# EAGLE schematic VNA (EAGLE 9.3.1)

## Sheet 1 of 10
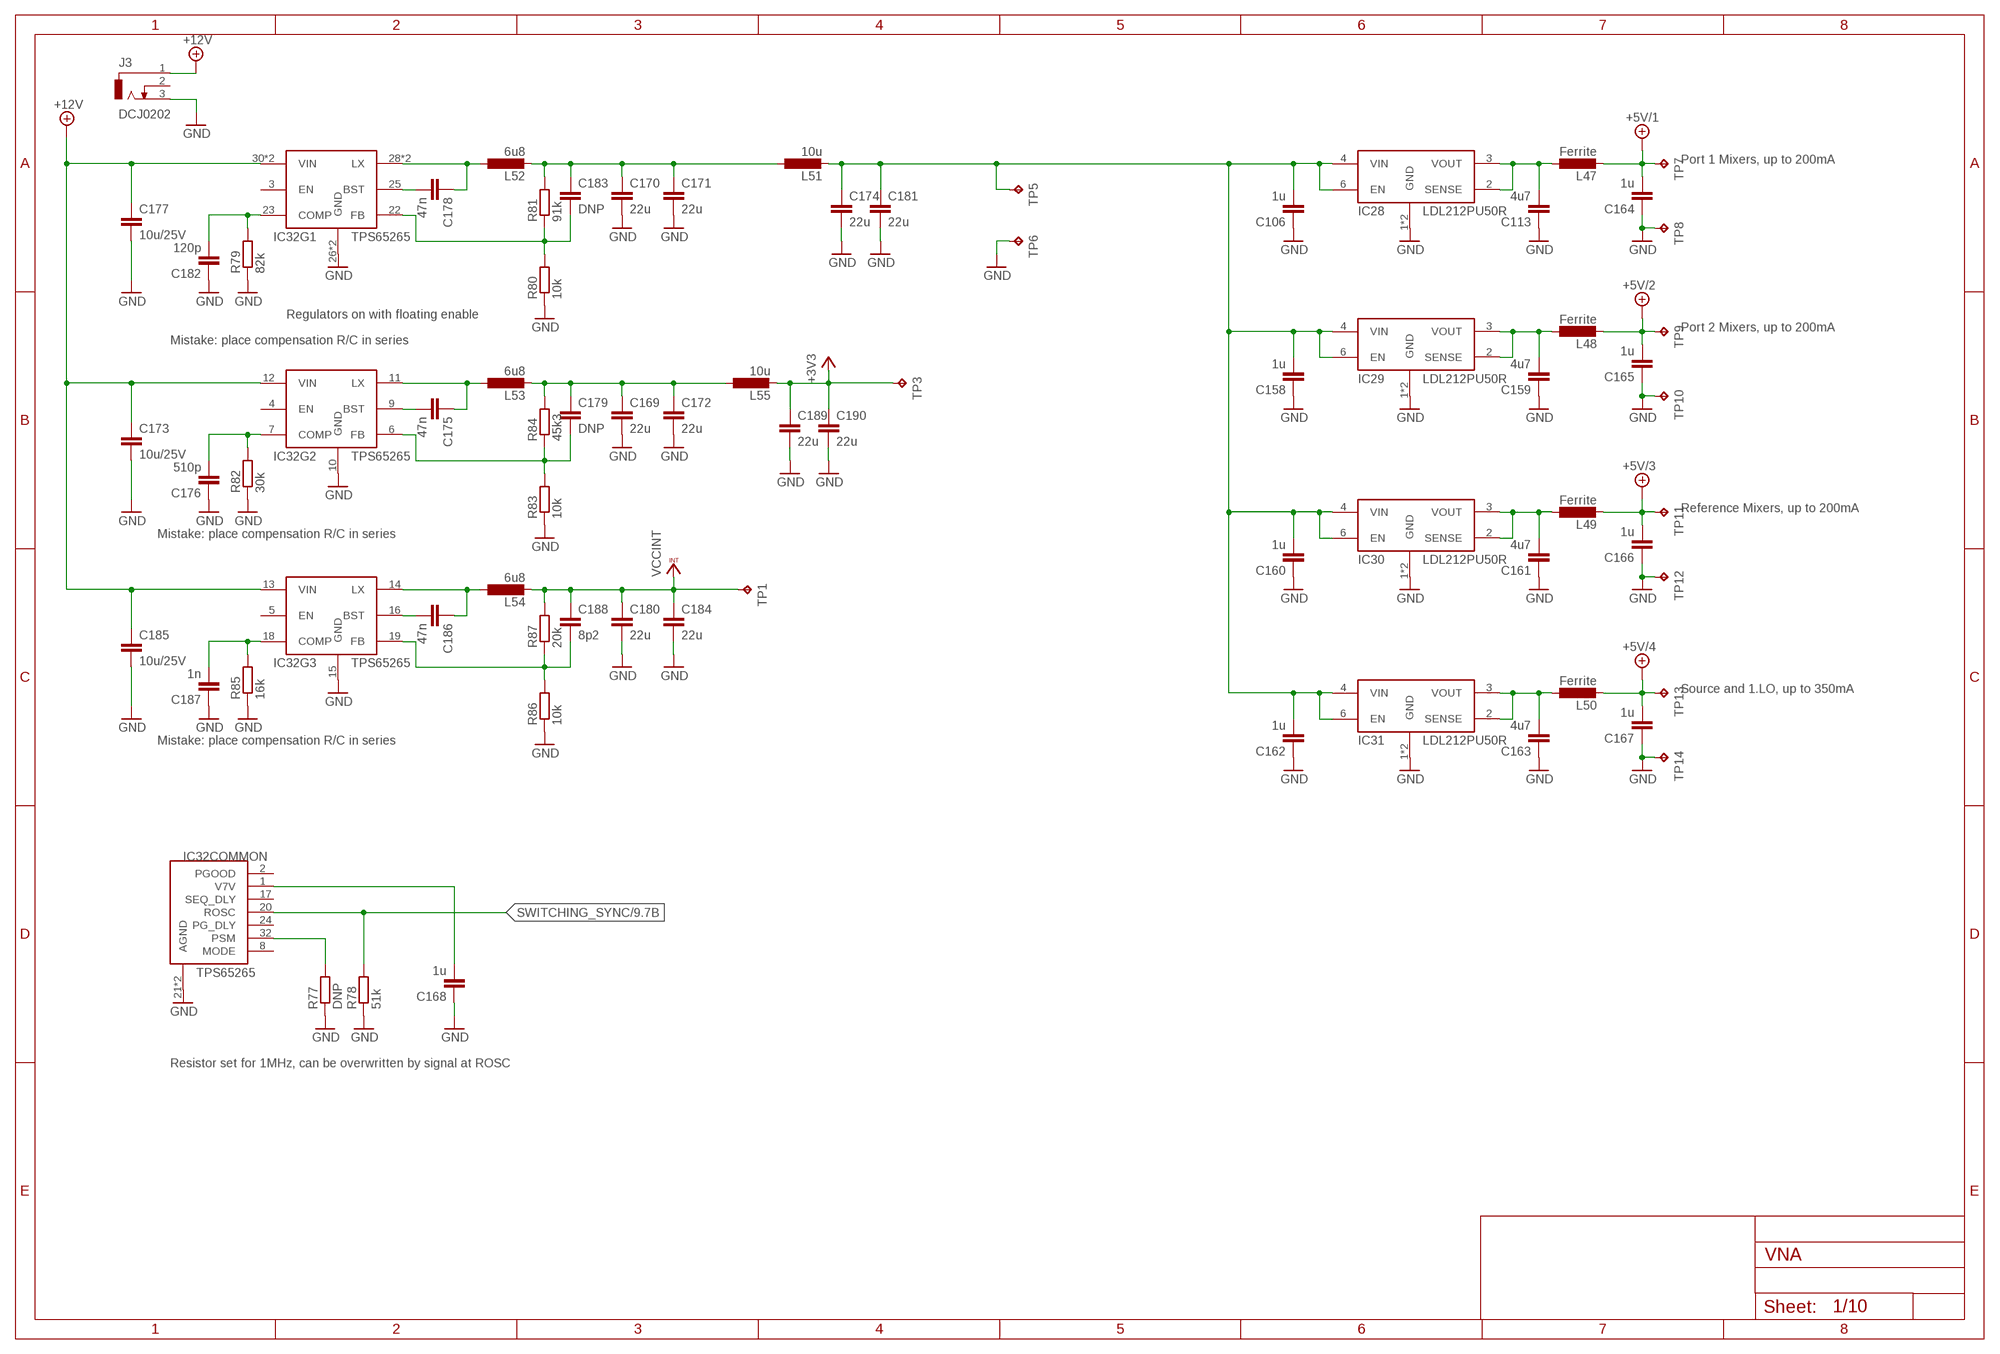
[diagram p0: schematic, sheet 1]

### Parts
C106  1u  C-EUC0603  [C0603]
C113  4u7  C-EUC0603  [C0603]
C158  1u  C-EUC0603  [C0603]
C159  4u7  C-EUC0603  [C0603]
C160  1u  C-EUC0603  [C0603]
C161  4u7  C-EUC0603  [C0603]
C162  1u  C-EUC0603  [C0603]
C163  4u7  C-EUC0603  [C0603]
C164  1u  C-EUC0603  [C0603]
C165  1u  C-EUC0603  [C0603]
C166  1u  C-EUC0603  [C0603]
C167  1u  C-EUC0603  [C0603]
C168  1u  C-EUC0603  [C0603]
C169  22u  C-EUC1206  [C1206]
C170  22u  C-EUC1206  [C1206]
C171  22u  C-EUC1206  [C1206]
C172  22u  C-EUC1206  [C1206]
C173  10u/25V  C-EUC1206  [C1206]
C174  22u  C-EUC1206  [C1206]
C175  47n  C-EUC0603  [C0603]
C176  510p  C-EUC0603  [C0603]
C177  10u/25V  C-EUC1206  [C1206]
C178  47n  C-EUC0603  [C0603]
C179  DNP  C-EUC0603  [C0603]
C180  22u  C-EUC1206  [C1206]
C181  22u  C-EUC1206  [C1206]
C182  120p  C-EUC0603  [C0603]
C183  DNP  C-EUC0603  [C0603]
C184  22u  C-EUC1206  [C1206]
C185  10u/25V  C-EUC1206  [C1206]
C186  47n  C-EUC0603  [C0603]
C187  1n  C-EUC0603  [C0603]
C188  8p2  C-EUC0603  [C0603]
C189  22u  C-EUC1206  [C1206]
C190  22u  C-EUC1206  [C1206]
IC28  LDL212PU50R  [SON95P300X300X100-7T170X240N]
IC29  LDL212PU50R  [SON95P300X300X100-7T170X240N]
IC30  LDL212PU50R  [SON95P300X300X100-7T170X240N]
IC31  LDL212PU50R  [SON95P300X300X100-7T170X240N]
IC32  TPS65265  [QFN50P500X500X100-33T345N]
J3  DCJ0202  [DCJ0202]
L47  Ferrite  INDUCTOR0603  [R0603]
L48  Ferrite  INDUCTOR0603  [R0603]
L49  Ferrite  INDUCTOR0603  [R0603]
L50  Ferrite  INDUCTOR0603  [R0603]
L51  10u  SRN5040  [SRN5040]
L52  6u8  SRN5040  [SRN5040]
L53  6u8  SRN5040  [SRN5040]
L54  6u8  SRN5040  [SRN5040]
L55  10u  SRN5040  [SRN5040]
R77  DNP  R-EU_R0603  [R0603]
R78  51k  R-EU_R0603  [R0603]
R79  82k  R-EU_R0603  [R0603]
R80  10k  R-EU_R0603  [R0603]
R81  91k  R-EU_R0603  [R0603]
R82  30k  R-EU_R0603  [R0603]
R83  10k  R-EU_R0603  [R0603]
R84  45k3  R-EU_R0603  [R0603]
R85  16k  R-EU_R0603  [R0603]
R86  10k  R-EU_R0603  [R0603]
R87  20k  R-EU_R0603  [R0603]
TP1  TPB1,27  [B1,27]
TP3  TPB1,27  [B1,27]
TP5  TPB1,27  [B1,27]
TP6  TPB1,27  [B1,27]
TP7  TPB1,27  [B1,27]
TP8  TPB1,27  [B1,27]
TP9  TPB1,27  [B1,27]
TP10  TPB1,27  [B1,27]
TP11  TPB1,27  [B1,27]
TP12  TPB1,27  [B1,27]
TP13  TPB1,27  [B1,27]
TP14  TPB1,27  [B1,27]

### Nets
+3V3: C189.1 C190.1 L55.P$2 TP3.TP ; also sheet 2,3,4,5,6,7,8,9,10
+5V/1: C164.2 L47.2 TP7.TP ; also sheet 6
+5V/2: C165.2 L48.2 TP9.TP ; also sheet 7
+5V/3: C166.2 L49.2 TP11.TP ; also sheet 8
+5V/4: C167.2 L50.2 TP13.TP ; also sheet 3,5
+12V: C173.1 C177.1 C185.1 IC32.12(VIN) IC32.13(VIN) IC32.30(VIN) IC32.31(VIN) J3.1
GND: C106.1 C113.1 C158.1 C159.1 C160.1 C161.1 C162.1 C163.1 C164.1 C165.1 C166.1 C167.1 C168.1 C169.2 C170.2 C171.2 C172.2 C173.2 C174.2 C176.1 C177.2 C180.2 C181.2 C182.1 C184.2 C185.2 C187.1 C189.2 C190.2 IC28.1(GND) IC28.7(GND) IC29.1(GND) IC29.7(GND) IC30.1(GND) IC30.7(GND) IC31.1(GND) IC31.7(GND) IC32.10(GND) IC32.15(GND) IC32.21(COMMON:AGND) IC32.26(GND) IC32.27(GND) IC32.33(COMMON:AGND) J3.3 R77.1 R78.1 R79.1 R80.1 R82.1 R83.1 R85.1 R86.1 TP6.TP TP8.TP TP10.TP TP12.TP TP14.TP ; also sheet 2,3,4,5,6,7,8,9,10
N$100: C113.2 IC28.2(SENSE) IC28.3(VOUT) L47.1
N$161: C159.2 IC29.2(SENSE) IC29.3(VOUT) L48.1
N$162: C168.2 IC32.1(COMMON:V7V)
N$163: C106.2 C158.2 C160.2 C162.2 C174.1 C181.1 IC28.4(VIN) IC28.6(EN) IC29.4(VIN) IC29.6(EN) IC30.4(VIN) IC30.6(EN) IC31.4(VIN) IC31.6(EN) L51.P$2 TP5.TP
N$164: C161.2 IC30.2(SENSE) IC30.3(VOUT) L49.1
N$166: C163.2 IC31.2(SENSE) IC31.3(VOUT) L50.1
N$167: IC32.32(COMMON:PSM) R77.2
N$168: C178.2 IC32.25(BST)
N$169: C178.1 IC32.28(LX) IC32.29(LX) L52.P$1
N$170: C175.2 IC32.9(BST)
N$171: C175.1 IC32.11(LX) L53.P$1
N$172: C176.2 IC32.7(COMP) R82.2
N$174: C182.2 IC32.23(COMP) R79.2
N$176: C183.2 IC32.22(FB) R80.2 R81.1
N$177: C170.1 C171.1 C183.1 L51.P$1 L52.P$2 R81.2
N$178: C179.2 IC32.6(FB) R83.2 R84.1
N$179: C169.1 C172.1 C179.1 L53.P$2 L55.P$1 R84.2
N$180: C186.2 IC32.16(BST)
N$181: C186.1 IC32.14(LX) L54.P$1
N$182: C187.2 IC32.18(COMP) R85.2
N$184: C188.2 IC32.19(FB) R86.2 R87.1
SWITCHING_SYNC: IC32.20(COMMON:ROSC) R78.2 ; also sheet 9
VCCINT: C180.1 C184.1 C188.1 L54.P$2 R87.2 TP1.TP ; also sheet 9
Unconnected: IC32.2(COMMON:PGOOD) IC32.3(EN) IC32.4(EN) IC32.5(EN) IC32.8(COMMON:MODE) IC32.17(COMMON:SEQ_DLY) IC32.24(COMMON:PG_DLY) J3.2

### Notes on the sheet
- Port 1 Mixers, up to 200mA
- Regulators on with floating enable
- Port 2 Mixers, up to 200mA
- Mistake: place compensation R/C in series
- Reference Mixers, up to 200mA
- Mistake: place compensation R/C in series
- Source and 1.LO, up to 350mA
- Mistake: place compensation R/C in series
- Resistor set for 1MHz, can be overwritten by signal at ROSC

## Sheet 2 of 10: CLK Generation
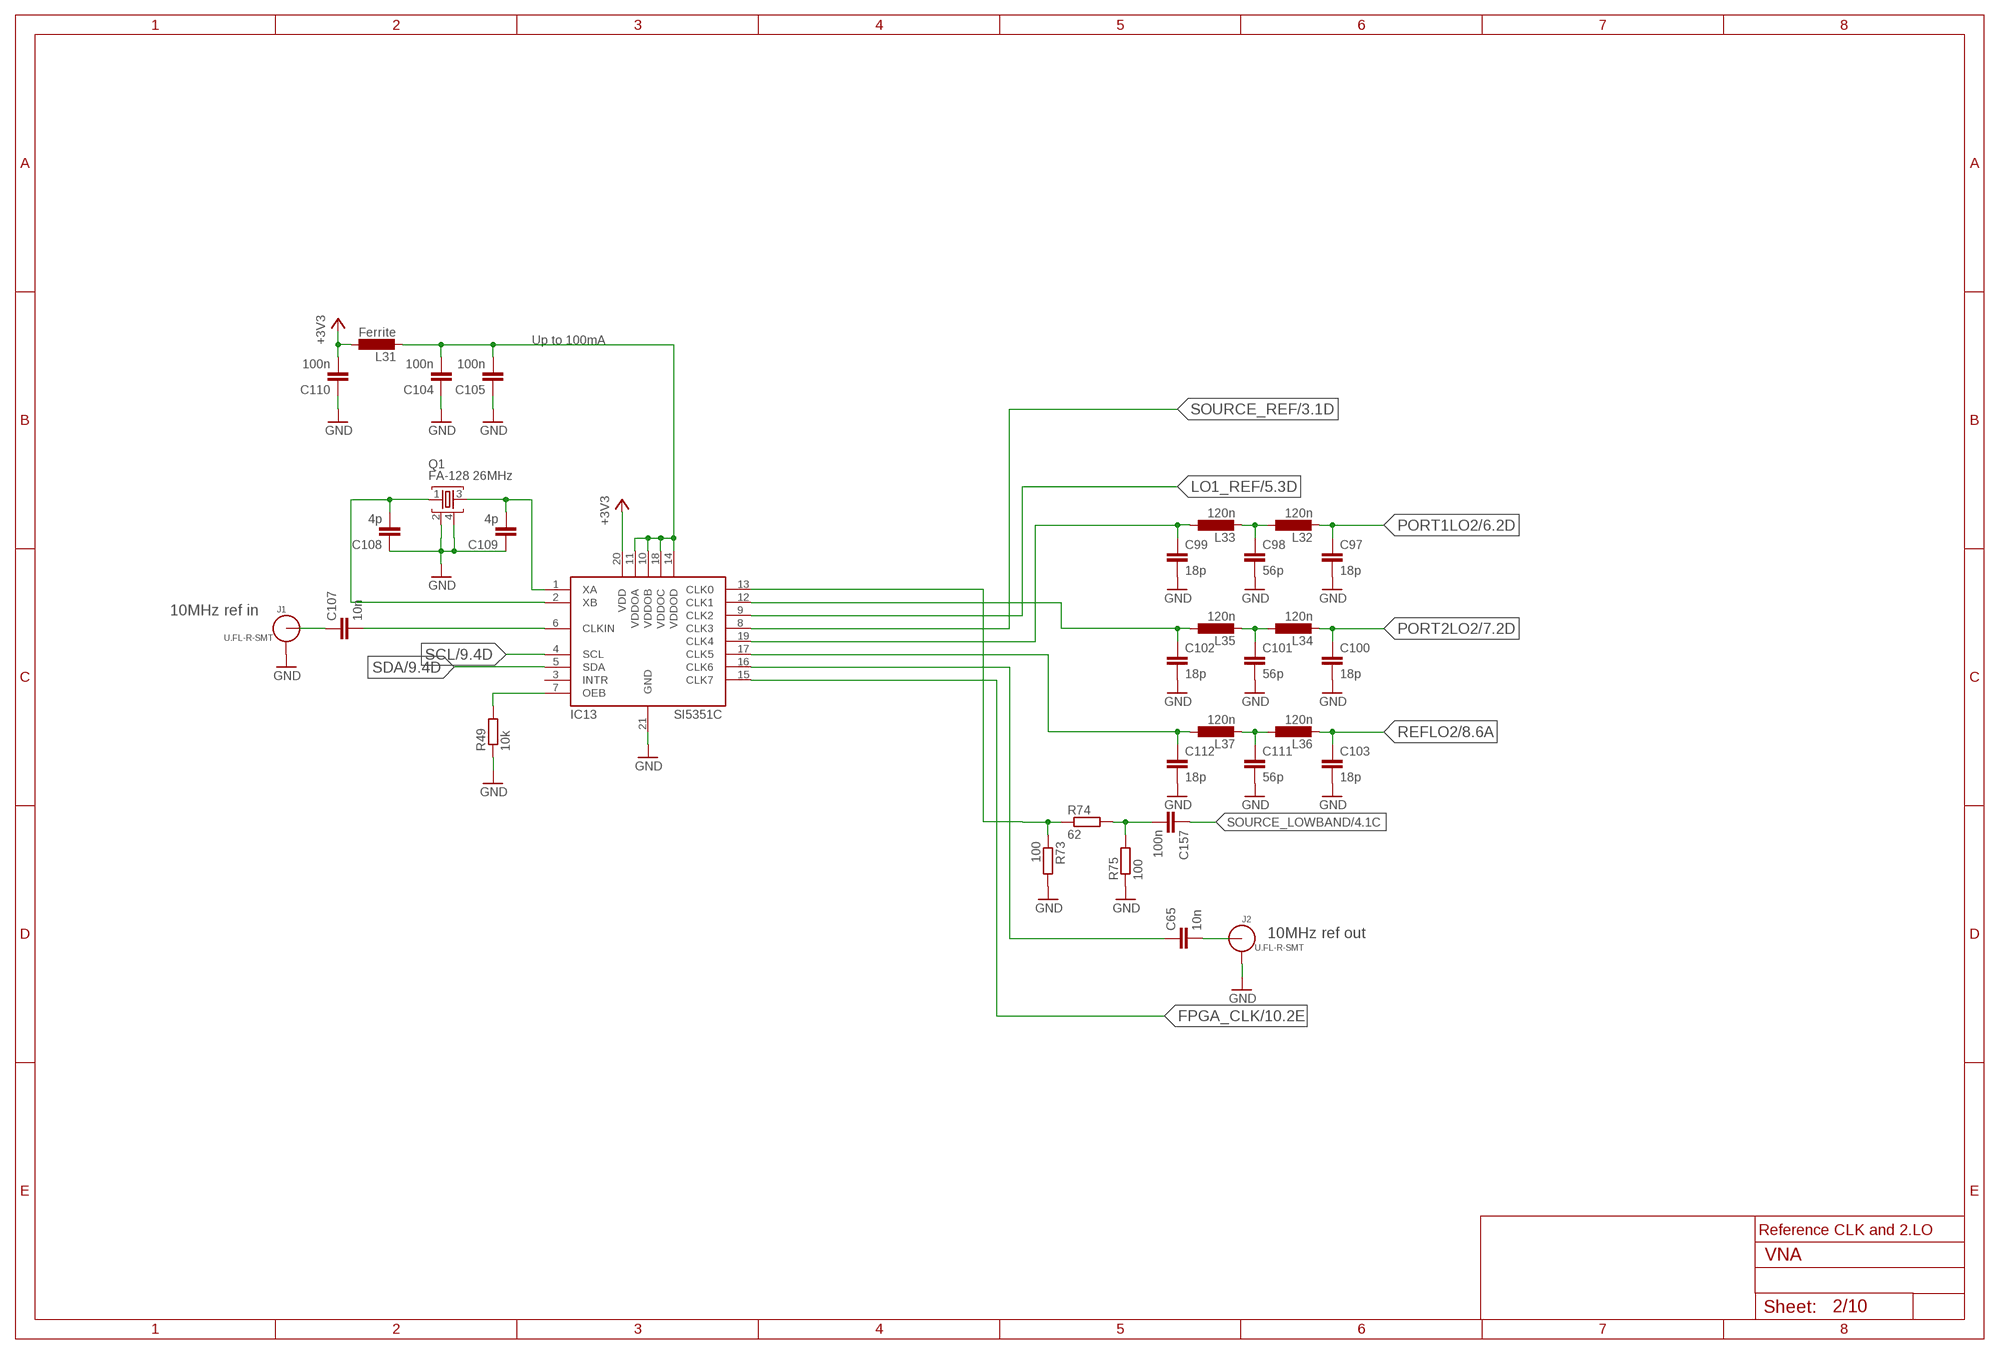
[diagram p1: schematic, sheet 2]

### Parts
C65  10n  C-EUC0603  [C0603]
C97  18p  C-EUC0603  [C0603]
C98  56p  C-EUC0603  [C0603]
C99  18p  C-EUC0603  [C0603]
C100  18p  C-EUC0603  [C0603]
C101  56p  C-EUC0603  [C0603]
C102  18p  C-EUC0603  [C0603]
C103  18p  C-EUC0603  [C0603]
C104  100n  C-EUC0603  [C0603]
C105  100n  C-EUC0603  [C0603]
C107  10n  C-EUC0603  [C0603]
C108  4p  C-EUC0603  [C0603]
C109  4p  C-EUC0603  [C0603]
C110  100n  C-EUC0603  [C0603]
C111  56p  C-EUC0603  [C0603]
C112  18p  C-EUC0603  [C0603]
C157  100n  C-EUC0603  [C0603]
IC13  SI5351C  [QFN50P400X400X90-21T270N]
J1  U.FL-R-SMT  [U.FL_SMT]
J2  U.FL-R-SMT  [U.FL_SMT]
L31  Ferrite  INDUCTOR0603  [R0603]
L32  120n  INDUCTOR0603  [R0603]
L33  120n  INDUCTOR0603  [R0603]
L34  120n  INDUCTOR0603  [R0603]
L35  120n  INDUCTOR0603  [R0603]
L36  120n  INDUCTOR0603  [R0603]
L37  120n  INDUCTOR0603  [R0603]
Q1  FA-128 26MHz  FA-128  [FA-128]
R49  10k  R-EU_R0603  [R0603]
R73  100  R-EU_R0603  [R0603]
R74  62  R-EU_R0603  [R0603]
R75  100  R-EU_R0603  [R0603]

### Nets
+3V3: C110.2 IC13.20(VDD) L31.1 ; also sheet 1,3,4,5,6,7,8,9,10
FPGA_CLK: IC13.15(CLK7) ; also sheet 10
GND: C97.2 C98.2 C99.2 C100.2 C101.2 C102.2 C103.2 C104.1 C105.1 C108.1 C109.1 C110.1 C111.2 C112.2 IC13.21(GND) J1.GND1 J1.GND2 J2.GND1 J2.GND2 Q1.2 Q1.4 R49.1 R73.2 R75.1 ; also sheet 1,3,4,5,6,7,8,9,10
LO1_REF: IC13.9(CLK2) ; also sheet 5
N$60: C65.2 J2.SIG(ANT)
N$91: C98.1 L32.1 L33.2
N$96: C101.1 L34.1 L35.2
N$97: C102.1 IC13.12(CLK1) L35.1
N$99: C111.1 L36.1 L37.2
N$101: C99.1 IC13.19(CLK4) L33.1
N$103: C65.1 IC13.16(CLK6)
N$107: C107.1 J1.SIG(ANT)
N$108: C107.2 IC13.6(CLKIN)
N$109: C104.2 C105.2 IC13.10(VDDOB) IC13.11(VDDOA) IC13.14(VDDOD) IC13.18(VDDOC) L31.2
N$112: IC13.7(OEB) R49.2
N$113: C109.2 IC13.1(XA) Q1.3
N$114: C108.2 IC13.2(XB) Q1.1
N$157: IC13.13(CLK0) R73.1 R74.1
N$159: C157.2 R74.2 R75.2
N$160: C112.1 IC13.17(CLK5) L37.1
PORT1LO2: C97.1 L32.2 ; also sheet 6
PORT2LO2: C100.1 L34.2 ; also sheet 7
REFLO2: C103.1 L36.2 ; also sheet 8
SCL: IC13.4(SCL) ; also sheet 9,10
SDA: IC13.5(SDA) ; also sheet 9,10
SOURCE_LOWBAND: C157.1 ; also sheet 4
SOURCE_REF: IC13.8(CLK3) ; also sheet 3
Unconnected: IC13.3(INTR)

### Notes on the sheet
- Up to 100mA
- 10MHz ref in
- 10MHz ref out
- Reference CLK and 2.LO

## Sheet 3 of 10: Source
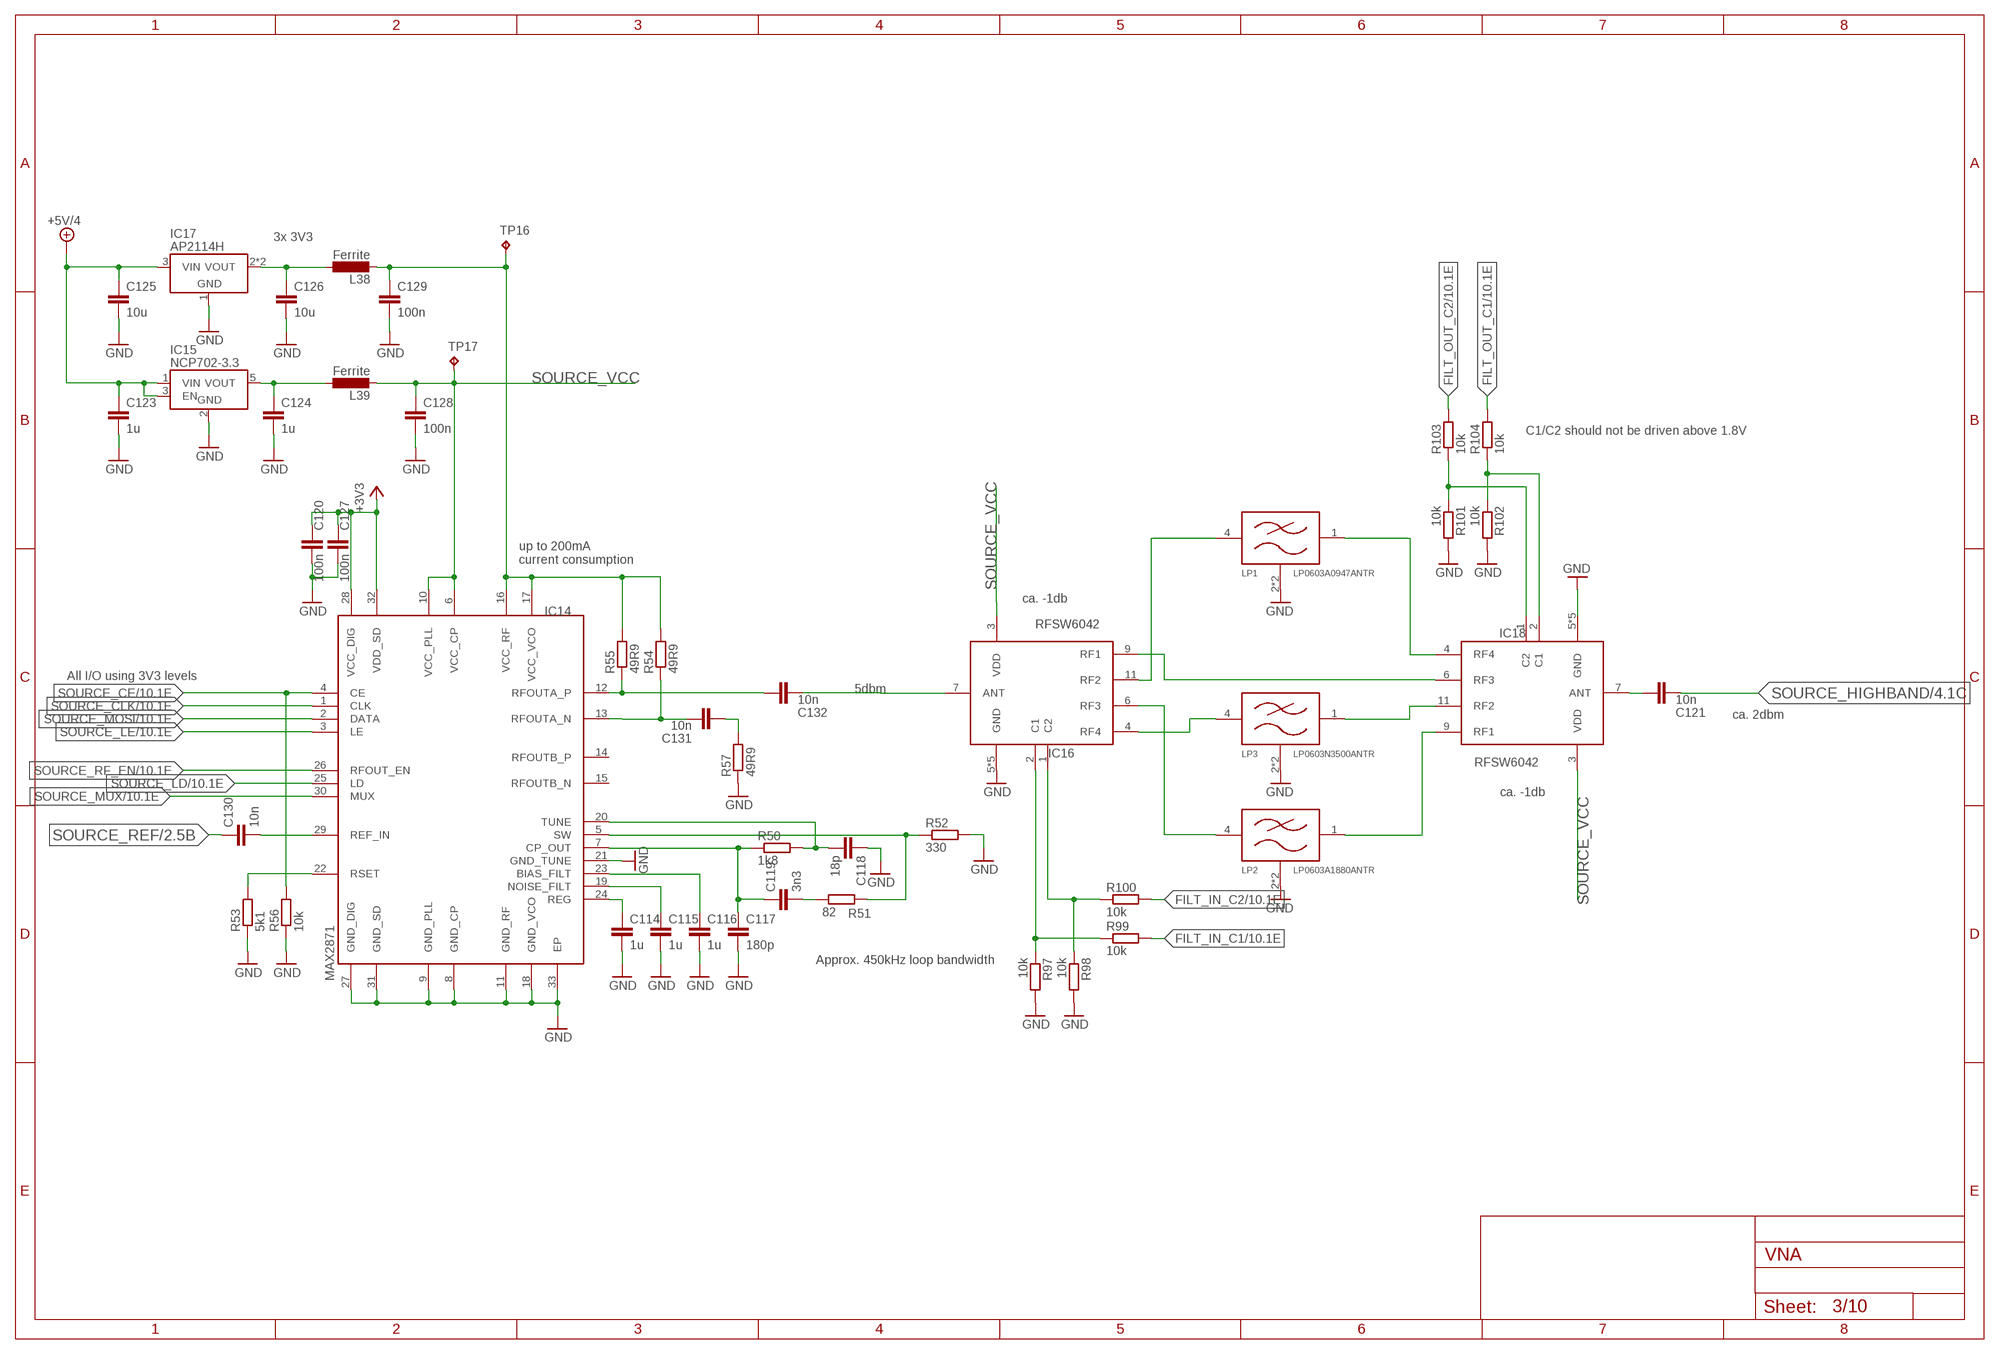
[diagram p2: schematic, sheet 3]

### Parts
C114  1u  C-EUC0603  [C0603]
C115  1u  C-EUC0603  [C0603]
C116  1u  C-EUC0603  [C0603]
C117  180p  C-EUC0603  [C0603]
C118  18p  C-EUC0603  [C0603]
C119  3n3  C-EUC0603  [C0603]
C120  100n  C-EUC0603  [C0603]
C121  10n  C-EUC0603  [C0603]
C123  1u  C-EUC0603  [C0603]
C124  1u  C-EUC0603  [C0603]
C125  10u  C-EUC1206  [C1206]
C126  10u  C-EUC1206  [C1206]
C127  100n  C-EUC0603  [C0603]
C128  100n  C-EUC0603  [C0603]
C129  100n  C-EUC0603  [C0603]
C130  10n  C-EUC0603  [C0603]
C131  10n  C-EUC0603  [C0603]
C132  10n  C-EUC0603  [C0603]
IC14  MAX2871  [QFN50P500X500X80-33T310]
IC15  NCP702-3.3  NCP702  [SOT95P240X110-5]
IC16  RFSW6042  [QFN40P180X180X55-13T76N]
IC17  AP2114H  [SOT230P700X180-4]
IC18  RFSW6042  [QFN40P180X180X55-13T76N]
L38  Ferrite  INDUCTOR0603  [R0603]
L39  Ferrite  INDUCTOR0603  [R0603]
LP1  LP0603A0947ANTR  LP0603A  [FILTRDFN160X84X70-4N]
LP2  LP0603A1880ANTR  LP0603A  [FILTRDFN160X84X70-4N]
LP3  LP0603N3500ANTR  LP0603A  [FILTRDFN160X84X70-4N]
R50  1k8  R-EU_R0603  [R0603]
R51  82  R-EU_R0603  [R0603]
R52  330  R-EU_R0603  [R0603]
R53  5k1  R-EU_R0603  [R0603]
R54  49R9  R-EU_R0603  [R0603]
R55  49R9  R-EU_R0603  [R0603]
R56  10k  R-EU_R0603  [R0603]
R57  49R9  R-EU_R0603  [R0603]
R97  10k  R-EU_R0603  [R0603]
R98  10k  R-EU_R0603  [R0603]
R99  10k  R-EU_R0603  [R0603]
R100  10k  R-EU_R0603  [R0603]
R101  10k  R-EU_R0603  [R0603]
R102  10k  R-EU_R0603  [R0603]
R103  10k  R-EU_R0603  [R0603]
R104  10k  R-EU_R0603  [R0603]
TP16  TPB1,27  [B1,27]
TP17  TPB1,27  [B1,27]

### Nets
+3V3: C120.1 C127.1 IC14.28(VCC_DIG) IC14.32(VDD_SD) ; also sheet 1,2,4,5,6,7,8,9,10
+5V/4: C123.1 C125.1 IC15.1(VIN) IC15.3(EN) IC17.3(VIN) ; also sheet 1,5
FILT_IN_C1: R99.2 ; also sheet 10
FILT_IN_C2: R100.2 ; also sheet 10
FILT_OUT_C1: R104.2 ; also sheet 10
FILT_OUT_C2: R103.2 ; also sheet 10
GND: C114.2 C115.2 C116.2 C117.2 C118.1 C120.2 C123.2 C124.2 C125.2 C126.2 C127.2 C128.2 C129.2 IC14.8(GND_CP) IC14.9(GND_PLL) IC14.11(GND_RF) IC14.18(GND_VCO) IC14.21(GND_TUNE) IC14.27(GND_DIG) IC14.31(GND_SD) IC14.33(EP) IC15.2(GND) IC16.5(GND) IC16.8(GND) IC16.10(GND) IC16.12(GND) IC16.13(GND) IC17.1(GND) IC18.5(GND) IC18.8(GND) IC18.10(GND) IC18.12(GND) IC18.13(GND) LP1.2(GND) LP1.3(GND) LP2.2(GND) LP2.3(GND) LP3.2(GND) LP3.3(GND) R52.2 R53.1 R56.1 R57.1 R97.2 R98.2 R101.2 R102.2 ; also sheet 1,2,4,5,6,7,8,9,10
N$64: C118.2 IC14.20(TUNE) R50.2
N$93: C117.1 C119.1 IC14.7(CP_OUT) R50.1
N$94: C114.1 IC14.24(REG)
N$98: C115.1 IC14.19(NOISE_FILT)
N$102: C116.1 IC14.23(BIAS_FILT)
N$104: C119.2 R51.1
N$105: IC14.5(SW) R51.2 R52.1
N$106: IC14.22(RSET) R53.2
N$110: C129.1 IC14.16(VCC_RF) IC14.17(VCC_VCO) L38.2 R54.2 R55.2 TP16.TP
N$116: C130.2 IC14.29(REF_IN)
N$117: C132.1 IC14.12(RFOUTA_P) R55.1
N$118: C131.2 IC14.13(RFOUTA_N) R54.1
N$119: C131.1 R57.2
N$120: C132.2 IC16.7(ANT)
N$121: IC16.9(RF1) IC18.6(RF3)
N$122: IC16.11(RF2) LP1.4(IN)
N$123: IC18.4(RF4) LP1.1(OUT)
N$124: IC18.11(RF2) LP3.1(OUT)
N$125: IC18.9(RF1) LP2.1(OUT)
N$126: IC16.6(RF3) LP2.4(IN)
N$127: IC16.4(RF4) LP3.4(IN)
N$128: C126.1 IC17.2(VOUT) IC17.4(VOUT) L38.1
N$129: C124.1 IC15.5(VOUT) L39.1
N$130: C121.1 IC18.7(ANT)
N$199: IC16.2(C1) R97.1 R99.1
N$200: IC16.1(C2) R98.1 R100.1
N$201: IC18.1(C2) R101.1 R103.1
N$202: IC18.2(C1) R102.1 R104.1
SOURCE_CE: IC14.4(CE) R56.2 ; also sheet 10
SOURCE_CLK: IC14.1(CLK) ; also sheet 10
SOURCE_HIGHBAND: C121.2 ; also sheet 4
SOURCE_LD: IC14.25(LD) ; also sheet 10
SOURCE_LE: IC14.3(LE) ; also sheet 10
SOURCE_MOSI: IC14.2(DATA) ; also sheet 10
SOURCE_MUX: IC14.30(MUX) ; also sheet 10
SOURCE_REF: C130.1 ; also sheet 2
SOURCE_RF_EN: IC14.26(RFOUT_EN) ; also sheet 10
SOURCE_VCC: C128.1 IC14.6(VCC_CP) IC14.10(VCC_PLL) IC16.3(VDD) IC18.3(VDD) L39.2 TP17.TP
Unconnected: IC14.14(RFOUTB_P) IC14.15(RFOUTB_N)

### Notes on the sheet
- 3x 3V3
- C1/C2 should not be driven above 1.8V
- up to 200mA
  current consumption
- ca. -1db
- All I/O using 3V3 levels
- 5dbm
- ca. 2dbm
- ca. -1db
- Approx. 450kHz loop bandwidth

## Sheet 4 of 10
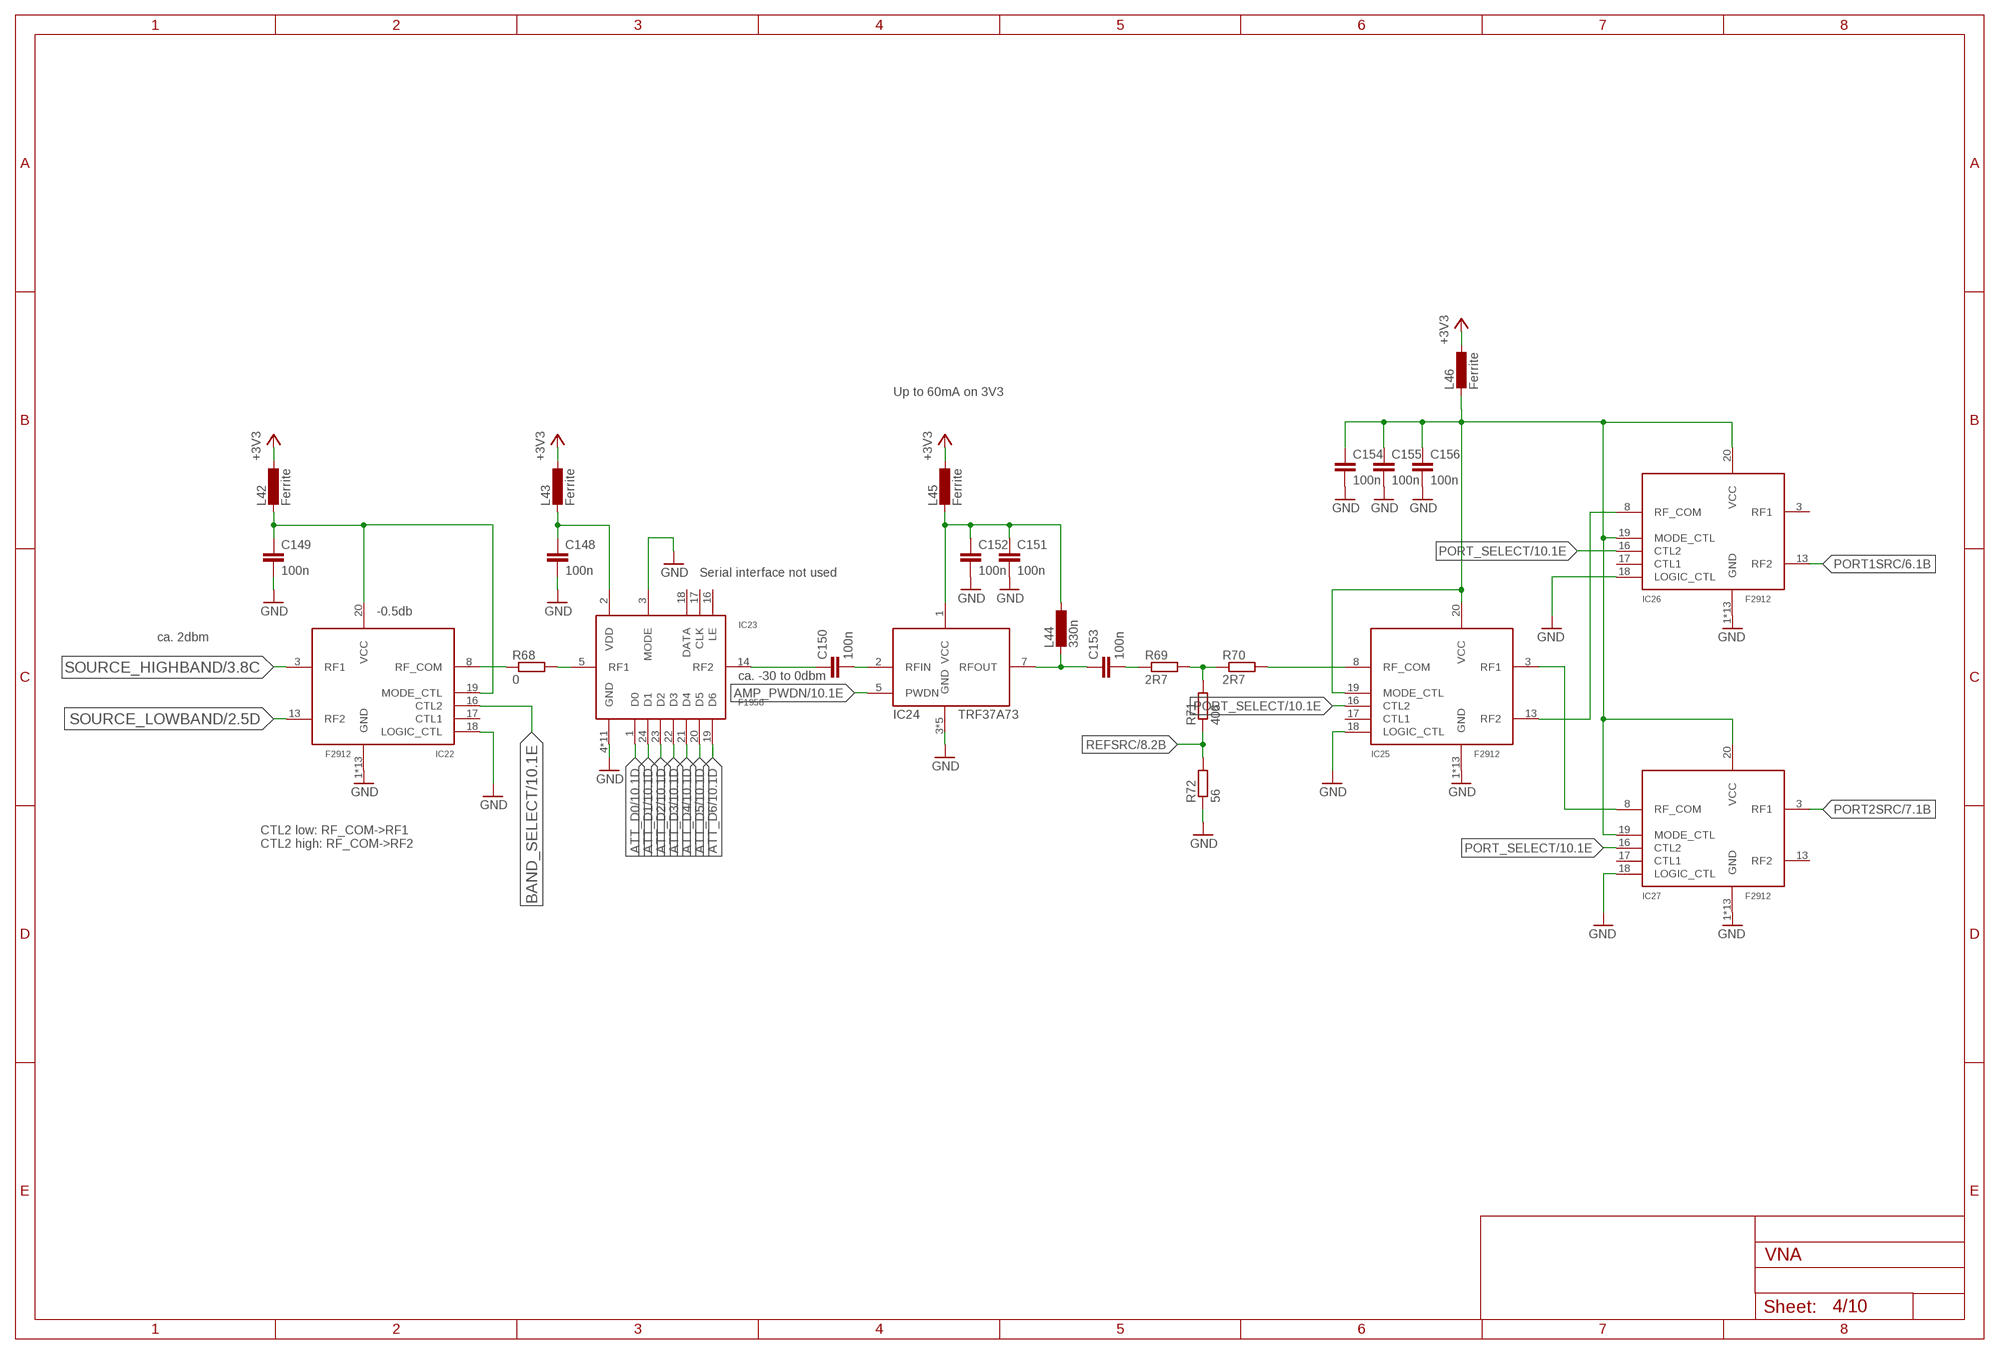
[diagram p3: schematic, sheet 4]

### Parts
C148  100n  C-EUC0603  [C0603]
C149  100n  C-EUC0603  [C0603]
C150  100n  C-EUC0603  [C0603]
C151  100n  C-EUC0603  [C0603]
C152  100n  C-EUC0603  [C0603]
C153  100n  C-EUC0603  [C0603]
C154  100n  C-EUC0603  [C0603]
C155  100n  C-EUC0603  [C0603]
C156  100n  C-EUC0603  [C0603]
IC22  F2912  [QFN50P400X400X75-21T206]
IC23  F1958  [QFN50P400X400X75-25T270]
IC24  TRF37A73  [SON50P200X200X80-9T90X160N]
IC25  F2912  [QFN50P400X400X75-21T206]
IC26  F2912  [QFN50P400X400X75-21T206]
IC27  F2912  [QFN50P400X400X75-21T206]
L42  Ferrite  INDUCTOR0603  [R0603]
L43  Ferrite  INDUCTOR0603  [R0603]
L44  330n  INDUCTOR0603  [R0603]
L45  Ferrite  INDUCTOR0603  [R0603]
L46  Ferrite  INDUCTOR0603  [R0603]
R68  0  R-EU_R0603  [R0603]
R69  2R7  R-EU_R0603  [R0603]
R70  2R7  R-EU_R0603  [R0603]
R71  406  R-EU_R0603  [R0603]
R72  56  R-EU_R0603  [R0603]

### Nets
+3V3: L42.1 L43.1 L45.1 L46.1 ; also sheet 1,2,3,5,6,7,8,9,10
AMP_PWDN: IC24.5(PWDN) ; also sheet 10
ATT_D0: IC23.1(D0) ; also sheet 10
ATT_D1: IC23.24(D1) ; also sheet 10
ATT_D2: IC23.23(D2) ; also sheet 10
ATT_D3: IC23.22(D3) ; also sheet 10
ATT_D4: IC23.21(D4) ; also sheet 10
ATT_D5: IC23.20(D5) ; also sheet 10
ATT_D6: IC23.19(D6) ; also sheet 10
BAND_SELECT: IC22.16(CTL2) ; also sheet 10
GND: C148.2 C149.2 C151.2 C152.2 C154.2 C155.2 C156.2 IC22.1(GND) IC22.2(GND) IC22.4(GND) IC22.5(GND) IC22.6(GND) IC22.7(GND) IC22.9(GND) IC22.10(GND) IC22.11(GND) IC22.12(GND) IC22.14(GND) IC22.15(GND) IC22.18(LOGIC_CTL) IC22.21(GND) IC23.3(MODE) IC23.4(GND) IC23.6(GND) IC23.7(GND) IC23.8(GND) IC23.9(GND) IC23.10(GND) IC23.11(GND) IC23.12(GND) IC23.13(GND) IC23.15(GND) IC23.25(GND) IC24.3(GND) IC24.4(GND) IC24.6(GND) IC24.8(GND) IC24.9(GND) IC25.1(GND) IC25.2(GND) IC25.4(GND) IC25.5(GND) IC25.6(GND) IC25.7(GND) IC25.9(GND) IC25.10(GND) IC25.11(GND) IC25.12(GND) IC25.14(GND) IC25.15(GND) IC25.18(LOGIC_CTL) IC25.21(GND) IC26.1(GND) IC26.2(GND) IC26.4(GND) IC26.5(GND) IC26.6(GND) IC26.7(GND) IC26.9(GND) IC26.10(GND) IC26.11(GND) IC26.12(GND) IC26.14(GND) IC26.15(GND) IC26.18(LOGIC_CTL) IC26.21(GND) IC27.1(GND) IC27.2(GND) IC27.4(GND) IC27.5(GND) IC27.6(GND) IC27.7(GND) IC27.9(GND) IC27.10(GND) IC27.11(GND) IC27.12(GND) IC27.14(GND) IC27.15(GND) IC27.18(LOGIC_CTL) IC27.21(GND) R72.1 ; also sheet 1,2,3,5,6,7,8,9,10
N$140: C149.1 IC22.19(MODE_CTL) IC22.20(VCC) L42.2
N$144: IC22.8(RF_COM) R68.1
N$145: C148.1 IC23.2(VDD) L43.2
N$146: C150.1 IC23.14(RF2)
N$148: C150.2 IC24.2(RFIN)
N$149: C153.1 IC24.7(RFOUT) L44.2
N$150: C153.2 R69.1
N$151: IC25.8(RF_COM) R70.2
N$152: C151.1 C152.1 IC24.1(VCC) L44.1 L45.2
N$153: R69.2 R70.1 R71.2
N$154: IC25.13(RF2) IC26.8(RF_COM)
N$155: IC25.3(RF1) IC27.8(RF_COM)
N$156: C154.1 C155.1 C156.1 IC25.19(MODE_CTL) IC25.20(VCC) IC26.19(MODE_CTL) IC26.20(VCC) IC27.19(MODE_CTL) IC27.20(VCC) L46.2
N$158: IC23.5(RF1) R68.2
PORT1SRC: IC26.13(RF2) ; also sheet 6
PORT2SRC: IC27.3(RF1) ; also sheet 7
PORT_SELECT: IC25.16(CTL2) IC26.16(CTL2) IC27.16(CTL2) ; also sheet 10
REFSRC: R71.1 R72.2 ; also sheet 8
SOURCE_HIGHBAND: IC22.3(RF1) ; also sheet 3
SOURCE_LOWBAND: IC22.13(RF2) ; also sheet 2
Unconnected: IC22.17(CTL1) IC23.16(LE) IC23.17(CLK) IC23.18(DATA) IC25.17(CTL1) IC26.3(RF1) IC26.17(CTL1) IC27.13(RF2) IC27.17(CTL1)

### Notes on the sheet
- Up to 60mA on 3V3
- Serial interface not used
- -0.5db
- ca. 2dbm
- ca. -30 to 0dbm
- CTL2 low: RF_COM->RF1
  CTL2 high: RF_COM->RF2

## Sheet 5 of 10: 1. LO
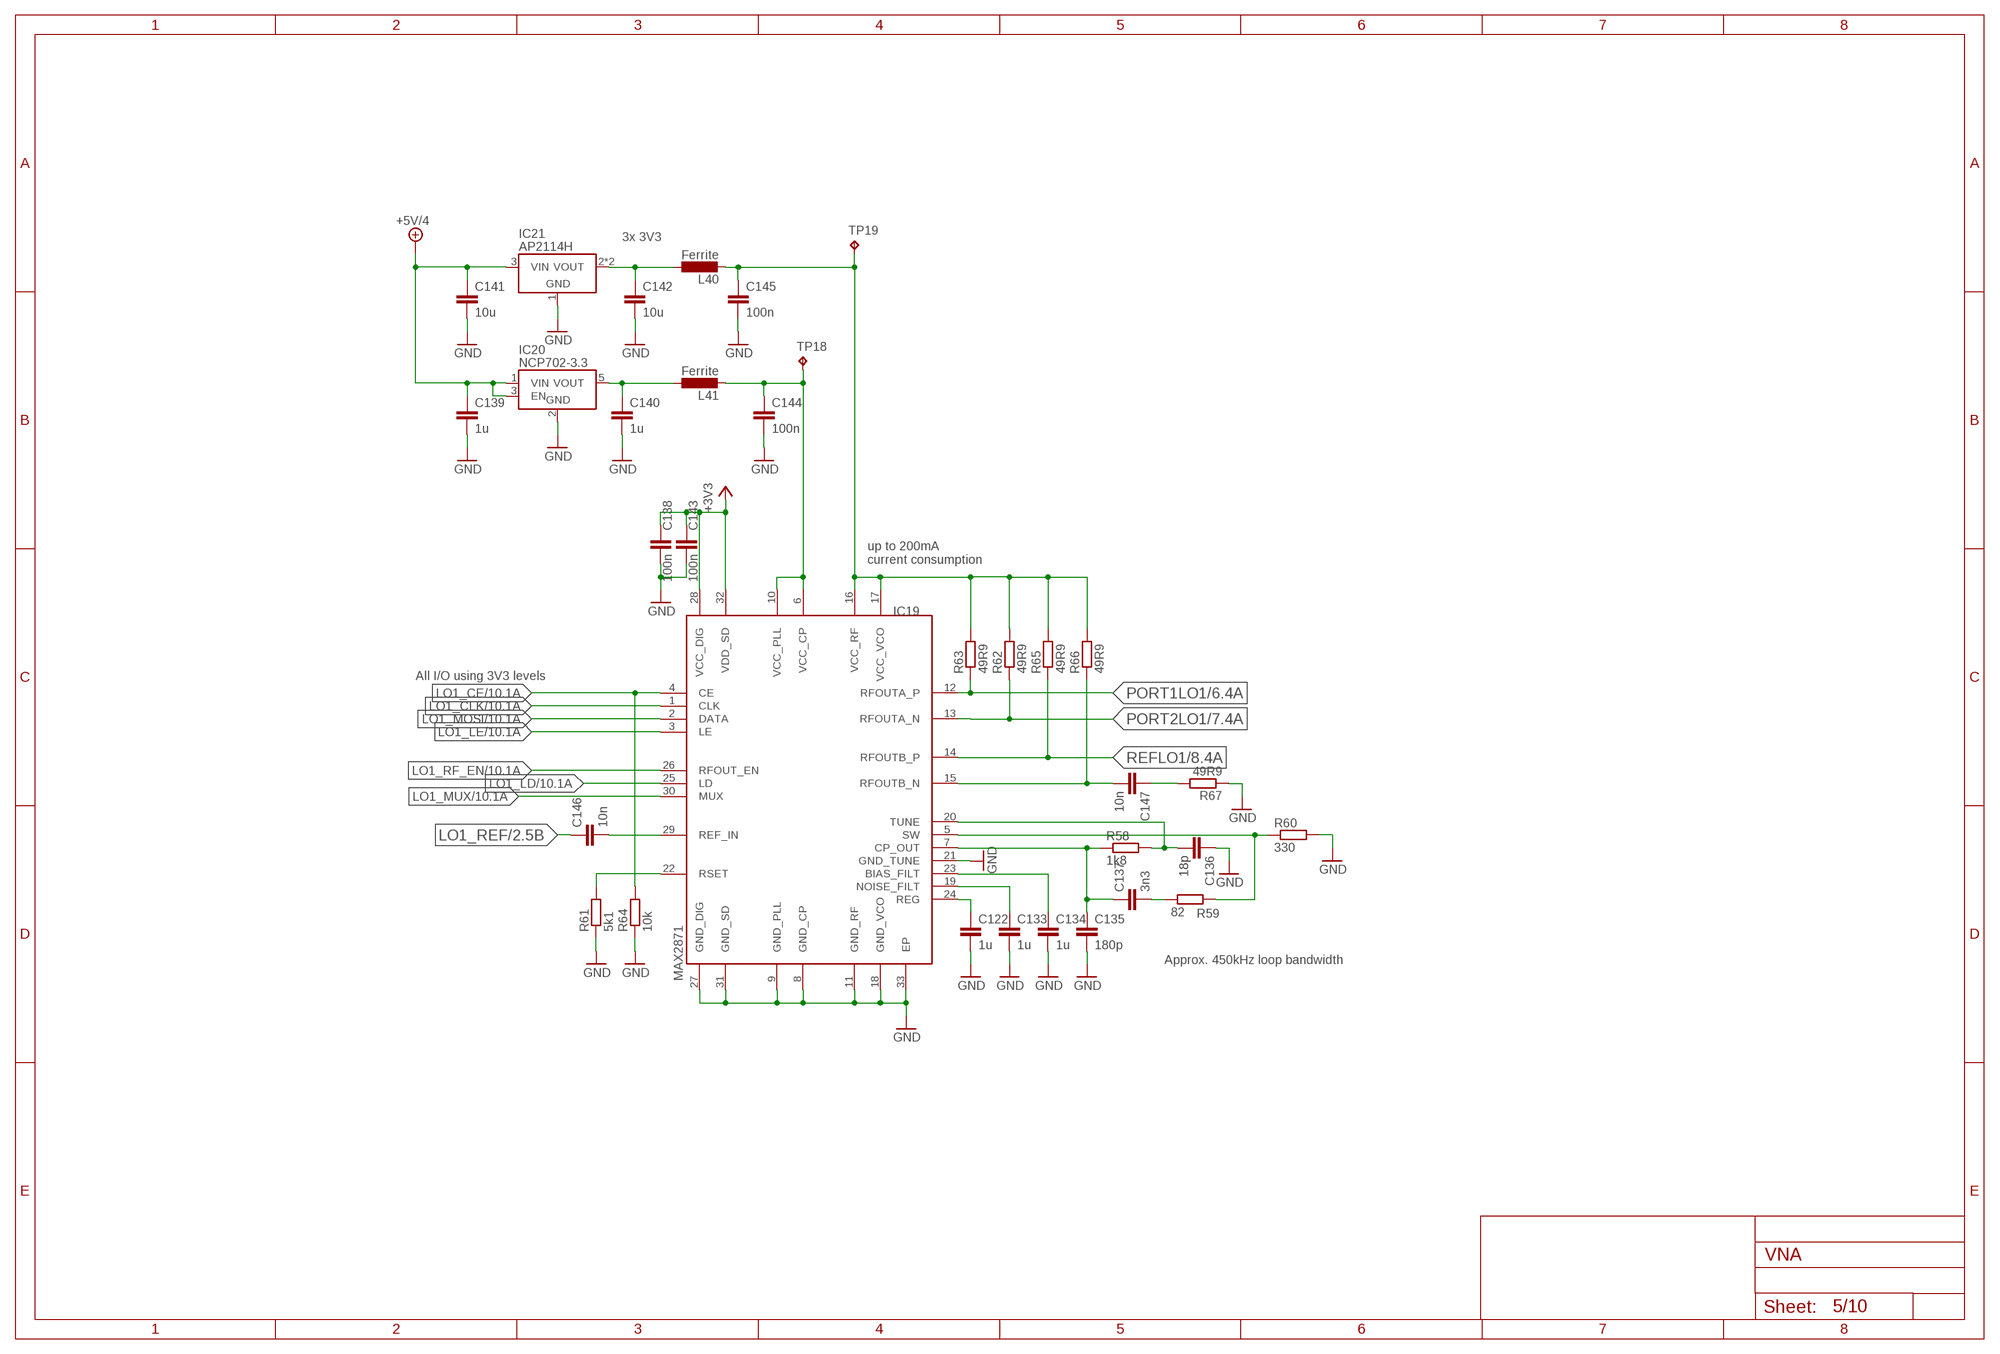
[diagram p4: schematic, sheet 5]

### Parts
C122  1u  C-EUC0603  [C0603]
C133  1u  C-EUC0603  [C0603]
C134  1u  C-EUC0603  [C0603]
C135  180p  C-EUC0603  [C0603]
C136  18p  C-EUC0603  [C0603]
C137  3n3  C-EUC0603  [C0603]
C138  100n  C-EUC0603  [C0603]
C139  1u  C-EUC0603  [C0603]
C140  1u  C-EUC0603  [C0603]
C141  10u  C-EUC1206  [C1206]
C142  10u  C-EUC1206  [C1206]
C143  100n  C-EUC0603  [C0603]
C144  100n  C-EUC0603  [C0603]
C145  100n  C-EUC0603  [C0603]
C146  10n  C-EUC0603  [C0603]
C147  10n  C-EUC0603  [C0603]
IC19  MAX2871  [QFN50P500X500X80-33T310]
IC20  NCP702-3.3  NCP702  [SOT95P240X110-5]
IC21  AP2114H  [SOT230P700X180-4]
L40  Ferrite  INDUCTOR0603  [R0603]
L41  Ferrite  INDUCTOR0603  [R0603]
R58  1k8  R-EU_R0603  [R0603]
R59  82  R-EU_R0603  [R0603]
R60  330  R-EU_R0603  [R0603]
R61  5k1  R-EU_R0603  [R0603]
R62  49R9  R-EU_R0603  [R0603]
R63  49R9  R-EU_R0603  [R0603]
R64  10k  R-EU_R0603  [R0603]
R65  49R9  R-EU_R0603  [R0603]
R66  49R9  R-EU_R0603  [R0603]
R67  49R9  R-EU_R0603  [R0603]
TP18  TPB1,27  [B1,27]
TP19  TPB1,27  [B1,27]

### Nets
+3V3: C138.1 C143.1 IC19.28(VCC_DIG) IC19.32(VDD_SD) ; also sheet 1,2,3,4,6,7,8,9,10
+5V/4: C139.1 C141.1 IC20.1(VIN) IC20.3(EN) IC21.3(VIN) ; also sheet 1,3
GND: C122.2 C133.2 C134.2 C135.2 C136.1 C138.2 C139.2 C140.2 C141.2 C142.2 C143.2 C144.2 C145.2 IC19.8(GND_CP) IC19.9(GND_PLL) IC19.11(GND_RF) IC19.18(GND_VCO) IC19.21(GND_TUNE) IC19.27(GND_DIG) IC19.31(GND_SD) IC19.33(EP) IC20.2(GND) IC21.1(GND) R60.2 R61.1 R64.1 R67.1 ; also sheet 1,2,3,4,6,7,8,9,10
LO1_CE: IC19.4(CE) R64.2 ; also sheet 10
LO1_CLK: IC19.1(CLK) ; also sheet 10
LO1_LD: IC19.25(LD) ; also sheet 10
LO1_LE: IC19.3(LE) ; also sheet 10
LO1_MOSI: IC19.2(DATA) ; also sheet 10
LO1_MUX: IC19.30(MUX) ; also sheet 10
LO1_REF: C146.1 ; also sheet 2
LO1_RF_EN: IC19.26(RFOUT_EN) ; also sheet 10
N$111: C144.1 IC19.6(VCC_CP) IC19.10(VCC_PLL) L41.2 TP18.TP
N$115: C136.2 IC19.20(TUNE) R58.2
N$131: C135.1 C137.1 IC19.7(CP_OUT) R58.1
N$132: C122.1 IC19.24(REG)
N$133: C133.1 IC19.19(NOISE_FILT)
N$134: C134.1 IC19.23(BIAS_FILT)
N$135: C137.2 R59.1
N$136: IC19.5(SW) R59.2 R60.1
N$137: IC19.22(RSET) R61.2
N$138: C145.1 IC19.16(VCC_RF) IC19.17(VCC_VCO) L40.2 R62.2 R63.2 R65.2 R66.2 TP19.TP
N$139: C146.2 IC19.29(REF_IN)
N$141: C147.1 R67.2
N$142: C142.1 IC21.2(VOUT) IC21.4(VOUT) L40.1
N$143: C140.1 IC20.5(VOUT) L41.1
N$147: C147.2 IC19.15(RFOUTB_N) R66.1
PORT1LO1: IC19.12(RFOUTA_P) R63.1 ; also sheet 6
PORT2LO1: IC19.13(RFOUTA_N) R62.1 ; also sheet 7
REFLO1: IC19.14(RFOUTB_P) R65.1 ; also sheet 8

### Notes on the sheet
- 3x 3V3
- up to 200mA
  current consumption
- All I/O using 3V3 levels
- Approx. 450kHz loop bandwidth

## Sheet 6 of 10: Port 1
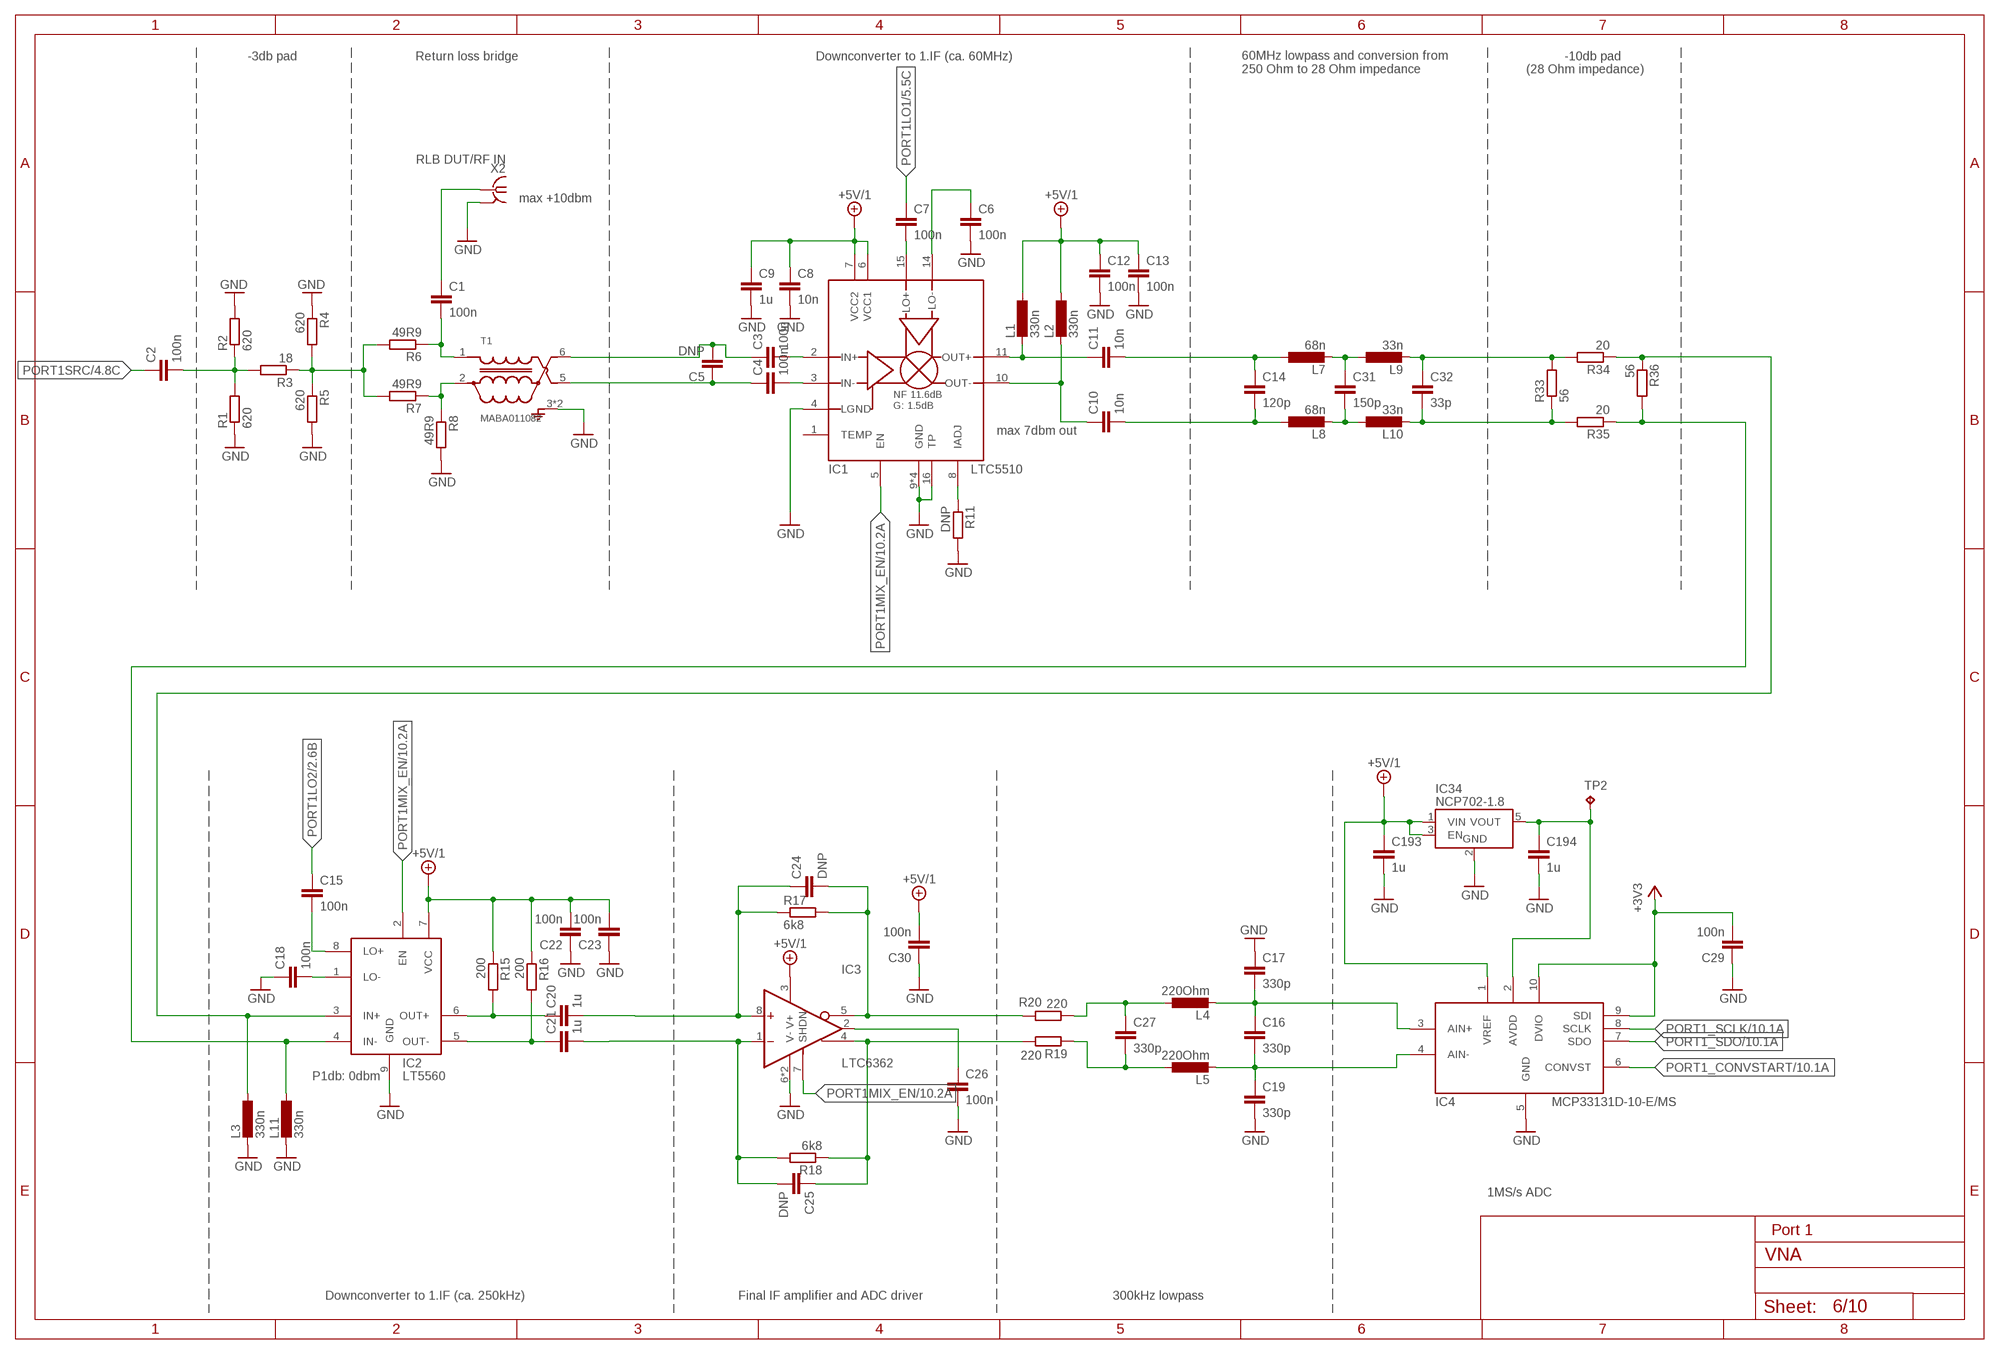
[diagram p5: schematic, sheet 6]

### Parts
C1  100n  C-EUC0603  [C0603]
C2  100n  C-EUC0603  [C0603]
C3  100n  C-EUC0603  [C0603]
C4  100n  C-EUC0603  [C0603]
C5  DNP  C-EUC0603  [C0603]
C6  100n  C-EUC0603  [C0603]
C7  100n  C-EUC0603  [C0603]
C8  10n  C-EUC0603  [C0603]
C9  1u  C-EUC0603  [C0603]
C10  10n  C-EUC0603  [C0603]
C11  10n  C-EUC0603  [C0603]
C12  100n  C-EUC0603  [C0603]
C13  100n  C-EUC0603  [C0603]
C14  120p  C-EUC0603  [C0603]
C15  100n  C-EUC0603  [C0603]
C16  330p  C-EUC0603  [C0603]
C17  330p  C-EUC0603  [C0603]
C18  100n  C-EUC0603  [C0603]
C19  330p  C-EUC0603  [C0603]
C20  1u  C-EUC0603  [C0603]
C21  1u  C-EUC0603  [C0603]
C22  100n  C-EUC0603  [C0603]
C23  100n  C-EUC0603  [C0603]
C24  DNP  C-EUC0603  [C0603]
C25  DNP  C-EUC0603  [C0603]
C26  100n  C-EUC0603  [C0603]
C27  330p  C-EUC0603  [C0603]
C29  100n  C-EUC0603  [C0603]
C30  100n  C-EUC0603  [C0603]
C31  150p  C-EUC0603  [C0603]
C32  33p  C-EUC0603  [C0603]
C193  1u  C-EUC0603  [C0603]
C194  1u  C-EUC0603  [C0603]
IC1  LTC5510  [QFN65P400X400X75-17T215N]
IC2  LT5560  [SON50P300X300X80-9T165X238]
IC3  LTC6362  [SON50P300X300X80-9T165X238]
IC4  MCP33131D-10-E/MS  [SOP50P490X110-10N]
IC34  NCP702-1.8  NCP702  [SOT95P240X110-5]
L1  330n  INDUCTOR0603  [R0603]
L2  330n  INDUCTOR0603  [R0603]
L3  330n  INDUCTOR0603  [R0603]
L4  220Ohm  INDUCTOR0603  [R0603]
L5  220Ohm  INDUCTOR0603  [R0603]
L7  68n  INDUCTOR0603  [R0603]
L8  68n  INDUCTOR0603  [R0603]
L9  33n  INDUCTOR0603  [R0603]
L10  33n  INDUCTOR0603  [R0603]
L11  330n  INDUCTOR0603  [R0603]
R1  620  R-EU_R0603  [R0603]
R2  620  R-EU_R0603  [R0603]
R3  18  R-EU_R0603  [R0603]
R4  620  R-EU_R0603  [R0603]
R5  620  R-EU_R0603  [R0603]
R6  49R9  R-EU_R0603  [R0603]
R7  49R9  R-EU_R0603  [R0603]
R8  49R9  R-EU_R0603  [R0603]
R11  DNP  R-EU_R0603  [R0603]
R15  200  R-EU_R0603  [R0603]
R16  200  R-EU_R0603  [R0603]
R17  6k8  R-EU_R0603  [R0603]
R18  6k8  R-EU_R0603  [R0603]
R19  220  R-EU_R0603  [R0603]
R20  220  R-EU_R0603  [R0603]
R33  56  R-EU_R0603  [R0603]
R34  20  R-EU_R0603  [R0603]
R35  20  R-EU_R0603  [R0603]
R36  56  R-EU_R0603  [R0603]
T1  MABA011082  [MACOM_BALUN]
TP2  TPB1,27  [B1,27]
X2  RLB DUT/RF IN  SMA_CONNECTOR  [J502-ND-142-0711-821/826]

### Nets
+3V3: C29.2 IC4.9(SDI) IC4.10(DVIO) ; also sheet 1,2,3,4,5,7,8,9,10
+5V/1: C8.1 C9.1 C12.1 C13.1 C22.2 C23.2 C30.2 C193.1 IC1.6(VCC1) IC1.7(VCC2) IC2.7(VCC) IC3.3(V+) IC4.1(VREF) IC34.1(VIN) IC34.3(EN) L1.1 L2.1 R15.1 R16.1 ; also sheet 1
GND: C6.2 C8.2 C9.2 C12.2 C13.2 C17.1 C18.1 C19.2 C22.1 C23.1 C26.2 C29.1 C30.1 C193.2 C194.2 IC1.4(LGND) IC1.9(GND) IC1.12(GND) IC1.13(GND) IC1.16(TP) IC1.17(GND) IC2.9(GND) IC3.6(V-) IC3.9(V-) IC4.5(GND) IC34.2(GND) L3.2 L11.2 R1.1 R2.2 R4.1 R5.2 R8.2 R11.2 T1.3(GND) T1.4(GND) X2.G@1 X2.G@2 X2.G@3 X2.G@4 ; also sheet 1,2,3,4,5,7,8,9,10
N$1: C2.2 R1.2 R2.1 R3.2
N$2: R3.1 R4.2 R5.1 R6.2 R7.2
N$3: C11.2 C14.1 L7.1
N$4: C1.2 R6.1 T1.1(PIN1)
N$5: R7.1 R8.1 T1.2(PIN2)
N$6: C1.1 X2.1
N$7: C3.2 IC1.2(IN+)
N$8: C4.2 IC1.3(IN-)
N$9: C4.1 C5.1 T1.5(PIN5)
N$10: C3.1 C5.2 T1.6(PIN6)
N$11: C6.1 IC1.14(LO-)
N$12: C7.2 IC1.15(LO+)
N$13: C16.1 C17.2 IC4.3(AIN+) L4.2
N$14: C11.1 IC1.11(OUT+) L1.2
N$15: C10.1 IC1.10(OUT-) L2.2
N$16: C10.2 C14.2 L8.1
N$17: C31.2 L8.2 L10.1
N$18: C15.2 IC2.8(LO+)
N$19: IC1.8(IADJ) R11.1
N$20: C16.2 C19.1 IC4.4(AIN-) L5.2
N$24: C18.2 IC2.1(LO-)
N$27: C20.1 IC2.6(OUT+) R15.2
N$28: C21.1 IC2.5(OUT-) R16.2
N$31: C25.1 IC3.4(+OUT) R18.1 R19.2
N$32: C24.2 IC3.5(-OUT) R17.2 R20.2
N$33: C31.1 L7.2 L9.1
N$34: IC2.3(IN+) L3.1 R34.1 R36.1
N$62: C32.1 L9.2 R33.2 R34.2
N$63: C32.2 L10.2 R33.1 R35.2
N$65: IC2.4(IN-) L11.1 R35.1 R36.2
N$92: C21.2 C25.2 IC3.1(-IN) R18.2
N$95: C20.2 C24.1 IC3.8(+IN) R17.1
N$203: C194.1 IC4.2(AVDD) IC34.5(VOUT) TP2.TP
OUT+: C27.1 L4.1 R20.1
OUT-: C27.2 L5.1 R19.1
OUT_CM: C26.1 IC3.2(VOCM)
PORT1_CONVSTART: IC4.6(CONVST) ; also sheet 10
PORT1_SCLK: IC4.8(SCLK) ; also sheet 10
PORT1_SDO: IC4.7(SDO) ; also sheet 10
PORT1LO1: C7.1 ; also sheet 5
PORT1LO2: C15.1 ; also sheet 2
PORT1MIX_EN: IC1.5(EN) IC2.2(EN) IC3.7(SHDN) ; also sheet 10
PORT1SRC: C2.1 ; also sheet 4
Unconnected: IC1.1(TEMP)

### Notes on the sheet
- -3db pad | Return loss bridge | Downconverter to 1.IF (ca. 60MHz) | -10db pad
- 60MHz lowpass and conversion from
  250 Ohm to 28 Ohm impedance
- (28 Ohm impedance)
- max +10dbm
- max 7dbm out
- P1db: 0dbm
- 1MS/s ADC
- Port 1
- Downconverter to 1.IF (ca. 250kHz) | Final IF amplifier and ADC driver | 300kHz lowpass

## Sheet 7 of 10: Port 2
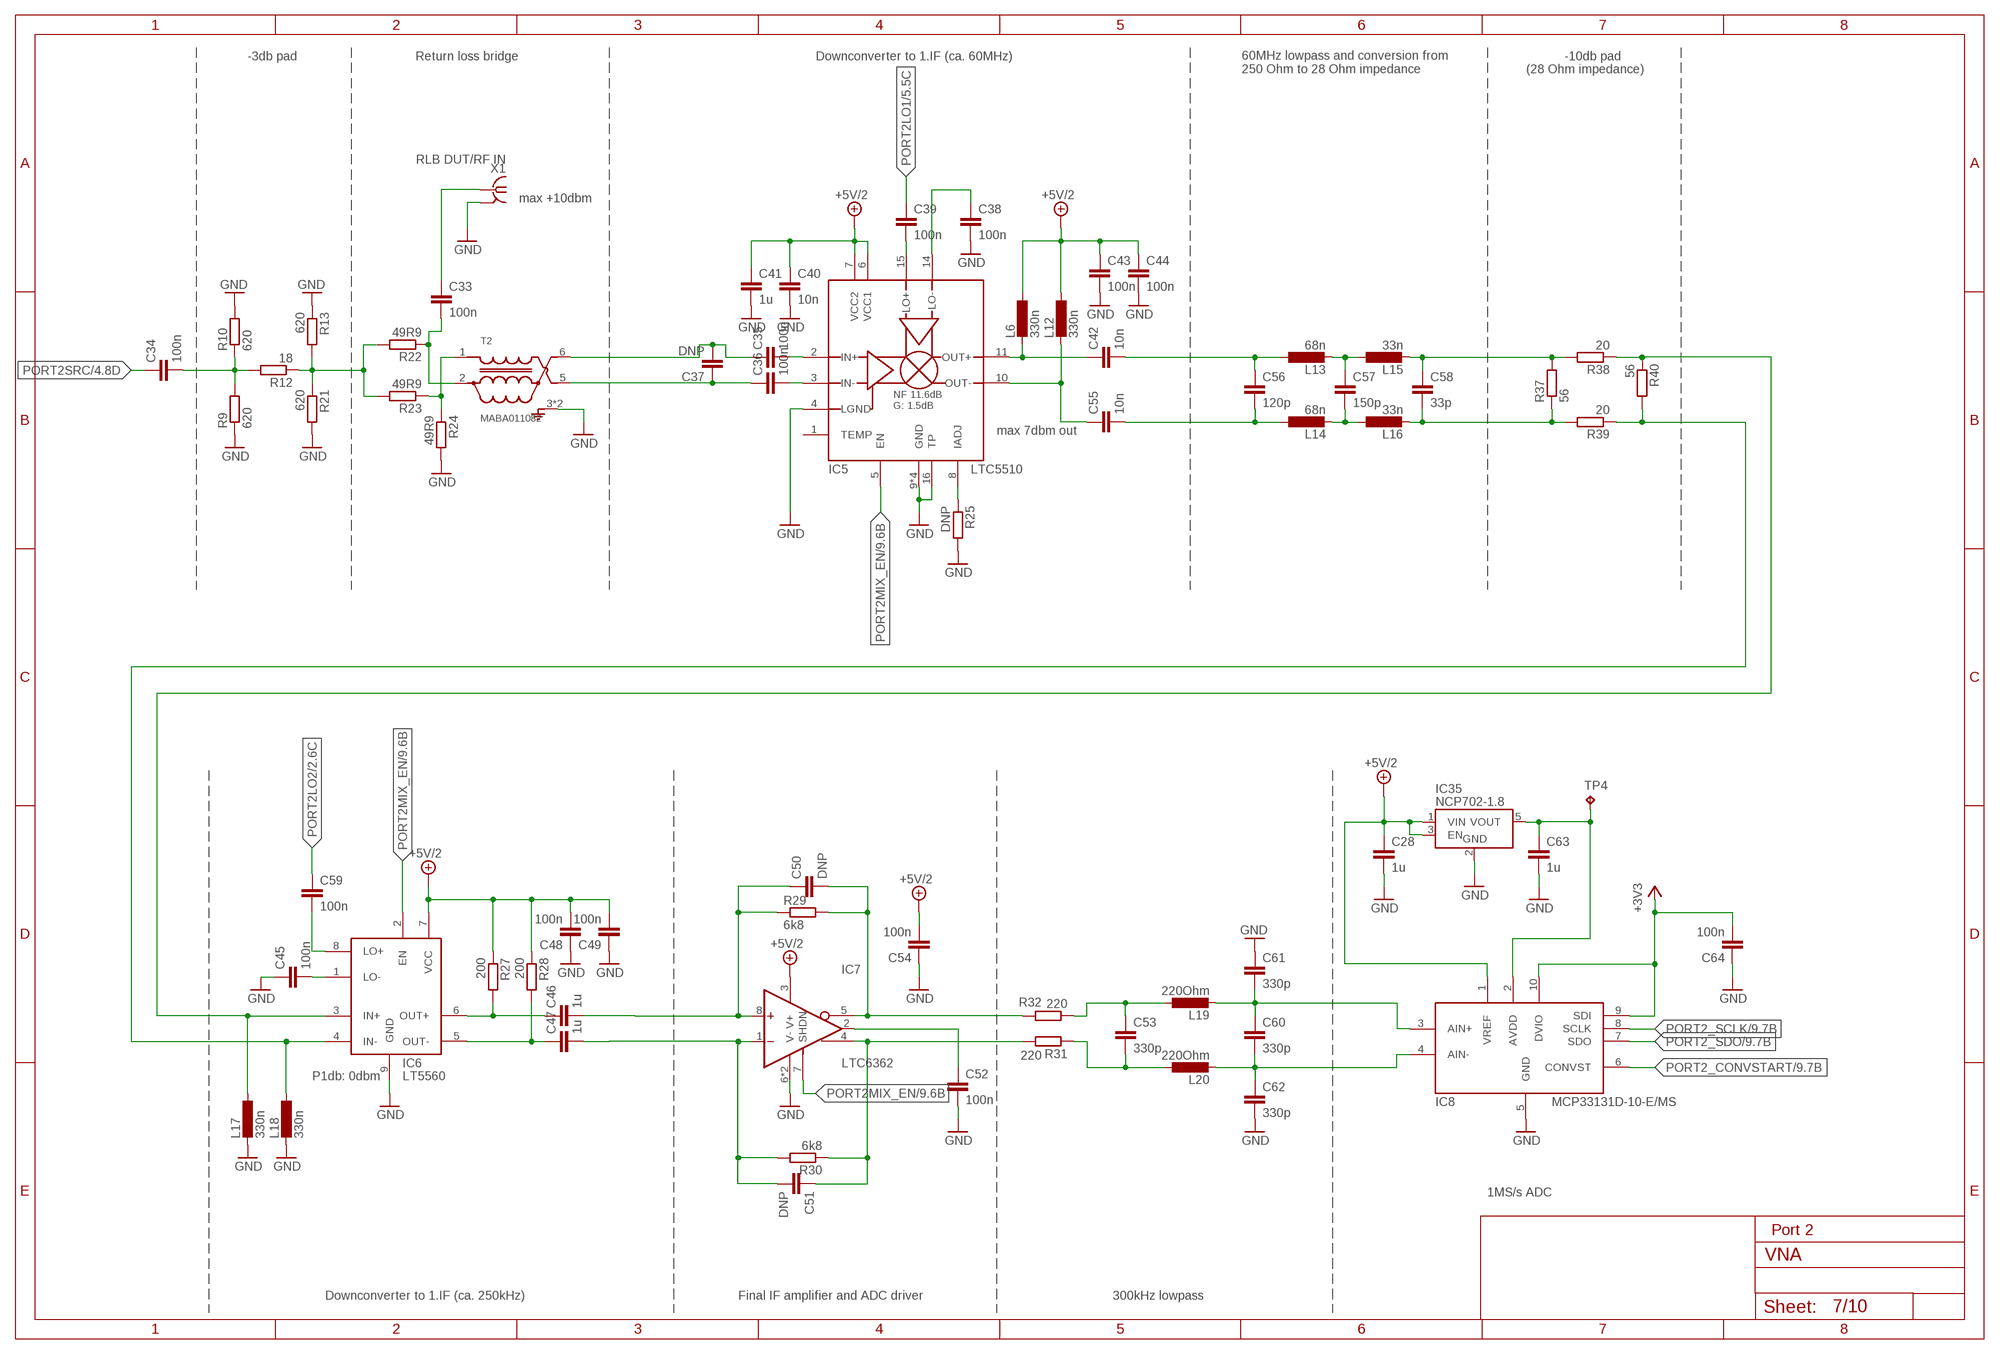
[diagram p6: schematic, sheet 7]

### Parts
C28  1u  C-EUC0603  [C0603]
C33  100n  C-EUC0603  [C0603]
C34  100n  C-EUC0603  [C0603]
C35  100n  C-EUC0603  [C0603]
C36  100n  C-EUC0603  [C0603]
C37  DNP  C-EUC0603  [C0603]
C38  100n  C-EUC0603  [C0603]
C39  100n  C-EUC0603  [C0603]
C40  10n  C-EUC0603  [C0603]
C41  1u  C-EUC0603  [C0603]
C42  10n  C-EUC0603  [C0603]
C43  100n  C-EUC0603  [C0603]
C44  100n  C-EUC0603  [C0603]
C45  100n  C-EUC0603  [C0603]
C46  1u  C-EUC0603  [C0603]
C47  1u  C-EUC0603  [C0603]
C48  100n  C-EUC0603  [C0603]
C49  100n  C-EUC0603  [C0603]
C50  DNP  C-EUC0603  [C0603]
C51  DNP  C-EUC0603  [C0603]
C52  100n  C-EUC0603  [C0603]
C53  330p  C-EUC0603  [C0603]
C54  100n  C-EUC0603  [C0603]
C55  10n  C-EUC0603  [C0603]
C56  120p  C-EUC0603  [C0603]
C57  150p  C-EUC0603  [C0603]
C58  33p  C-EUC0603  [C0603]
C59  100n  C-EUC0603  [C0603]
C60  330p  C-EUC0603  [C0603]
C61  330p  C-EUC0603  [C0603]
C62  330p  C-EUC0603  [C0603]
C63  1u  C-EUC0603  [C0603]
C64  100n  C-EUC0603  [C0603]
IC5  LTC5510  [QFN65P400X400X75-17T215N]
IC6  LT5560  [SON50P300X300X80-9T165X238]
IC7  LTC6362  [SON50P300X300X80-9T165X238]
IC8  MCP33131D-10-E/MS  [SOP50P490X110-10N]
IC35  NCP702-1.8  NCP702  [SOT95P240X110-5]
L6  330n  INDUCTOR0603  [R0603]
L12  330n  INDUCTOR0603  [R0603]
L13  68n  INDUCTOR0603  [R0603]
L14  68n  INDUCTOR0603  [R0603]
L15  33n  INDUCTOR0603  [R0603]
L16  33n  INDUCTOR0603  [R0603]
L17  330n  INDUCTOR0603  [R0603]
L18  330n  INDUCTOR0603  [R0603]
L19  220Ohm  INDUCTOR0603  [R0603]
L20  220Ohm  INDUCTOR0603  [R0603]
R9  620  R-EU_R0603  [R0603]
R10  620  R-EU_R0603  [R0603]
R12  18  R-EU_R0603  [R0603]
R13  620  R-EU_R0603  [R0603]
R21  620  R-EU_R0603  [R0603]
R22  49R9  R-EU_R0603  [R0603]
R23  49R9  R-EU_R0603  [R0603]
R24  49R9  R-EU_R0603  [R0603]
R25  DNP  R-EU_R0603  [R0603]
R27  200  R-EU_R0603  [R0603]
R28  200  R-EU_R0603  [R0603]
R29  6k8  R-EU_R0603  [R0603]
R30  6k8  R-EU_R0603  [R0603]
R31  220  R-EU_R0603  [R0603]
R32  220  R-EU_R0603  [R0603]
R37  56  R-EU_R0603  [R0603]
R38  20  R-EU_R0603  [R0603]
R39  20  R-EU_R0603  [R0603]
R40  56  R-EU_R0603  [R0603]
T2  MABA011082  [MACOM_BALUN]
TP4  TPB1,27  [B1,27]
X1  RLB DUT/RF IN  SMA_CONNECTOR  [J502-ND-142-0711-821/826]

### Nets
+3V3: C64.2 IC8.9(SDI) IC8.10(DVIO) ; also sheet 1,2,3,4,5,6,8,9,10
+5V/2: C28.1 C40.1 C41.1 C43.1 C44.1 C48.2 C49.2 C54.2 IC5.6(VCC1) IC5.7(VCC2) IC6.7(VCC) IC7.3(V+) IC8.1(VREF) IC35.1(VIN) IC35.3(EN) L6.1 L12.1 R27.1 R28.1 ; also sheet 1
GND: C28.2 C38.2 C40.2 C41.2 C43.2 C44.2 C45.1 C48.1 C49.1 C52.2 C54.1 C61.1 C62.2 C63.2 C64.1 IC5.4(LGND) IC5.9(GND) IC5.12(GND) IC5.13(GND) IC5.16(TP) IC5.17(GND) IC6.9(GND) IC7.6(V-) IC7.9(V-) IC8.5(GND) IC35.2(GND) L17.2 L18.2 R9.1 R10.2 R13.1 R21.2 R24.2 R25.2 T2.3(GND) T2.4(GND) X1.G@1 X1.G@2 X1.G@3 X1.G@4 ; also sheet 1,2,3,4,5,6,8,9,10
N$21: C34.2 R9.2 R10.1 R12.2
N$22: R12.1 R13.2 R21.1 R22.2 R23.2
N$23: C33.2 R22.1 T2.2(PIN2)
N$25: R23.1 R24.1 T2.1(PIN1)
N$26: C33.1 X1.1
N$29: C35.2 IC5.2(IN+)
N$30: C36.2 IC5.3(IN-)
N$35: C36.1 C37.1 T2.5(PIN5)
N$36: C35.1 C37.2 T2.6(PIN6)
N$37: C38.1 IC5.14(LO-)
N$38: C39.2 IC5.15(LO+)
N$39: C42.1 IC5.11(OUT+) L6.2
N$40: C55.1 IC5.10(OUT-) L12.2
N$41: IC5.8(IADJ) R25.1
N$42: C45.2 IC6.1(LO-)
N$43: C46.1 IC6.6(OUT+) R27.2
N$44: C47.1 IC6.5(OUT-) R28.2
N$45: C51.1 IC7.4(+OUT) R30.1 R31.2
N$46: C50.2 IC7.5(-OUT) R29.2 R32.2
N$47: C42.2 C56.1 L13.1
N$48: C55.2 C56.2 L14.1
N$49: C57.2 L14.2 L16.1
N$50: C57.1 L13.2 L15.1
N$51: IC6.3(IN+) L17.1 R38.1 R40.1
N$52: C59.2 IC6.8(LO+)
N$53: C60.1 C61.2 IC8.3(AIN+) L19.2
N$54: C60.2 C62.1 IC8.4(AIN-) L20.2
N$55: C58.1 L15.2 R37.2 R38.2
N$56: C58.2 L16.2 R37.1 R39.2
N$57: IC6.4(IN-) L18.1 R39.1 R40.2
N$58: C47.2 C51.2 IC7.1(-IN) R30.2
N$59: C46.2 C50.1 IC7.8(+IN) R29.1
N$204: C63.1 IC8.2(AVDD) IC35.5(VOUT) TP4.TP
OUT+1: C53.1 L19.1 R32.1
OUT-1: C53.2 L20.1 R31.1
OUT_CM1: C52.1 IC7.2(VOCM)
PORT2_CONVSTART: IC8.6(CONVST) ; also sheet 9
PORT2_SCLK: IC8.8(SCLK) ; also sheet 9
PORT2_SDO: IC8.7(SDO) ; also sheet 9
PORT2LO1: C39.1 ; also sheet 5
PORT2LO2: C59.1 ; also sheet 2
PORT2MIX_EN: IC5.5(EN) IC6.2(EN) IC7.7(SHDN) ; also sheet 9
PORT2SRC: C34.1 ; also sheet 4
Unconnected: IC5.1(TEMP)

### Notes on the sheet
- -3db pad | Return loss bridge | Downconverter to 1.IF (ca. 60MHz) | -10db pad
- 60MHz lowpass and conversion from
  250 Ohm to 28 Ohm impedance
- (28 Ohm impedance)
- max +10dbm
- max 7dbm out
- P1db: 0dbm
- 1MS/s ADC
- Port 2
- Downconverter to 1.IF (ca. 250kHz) | Final IF amplifier and ADC driver | 300kHz lowpass

## Sheet 8 of 10: Ref Signal
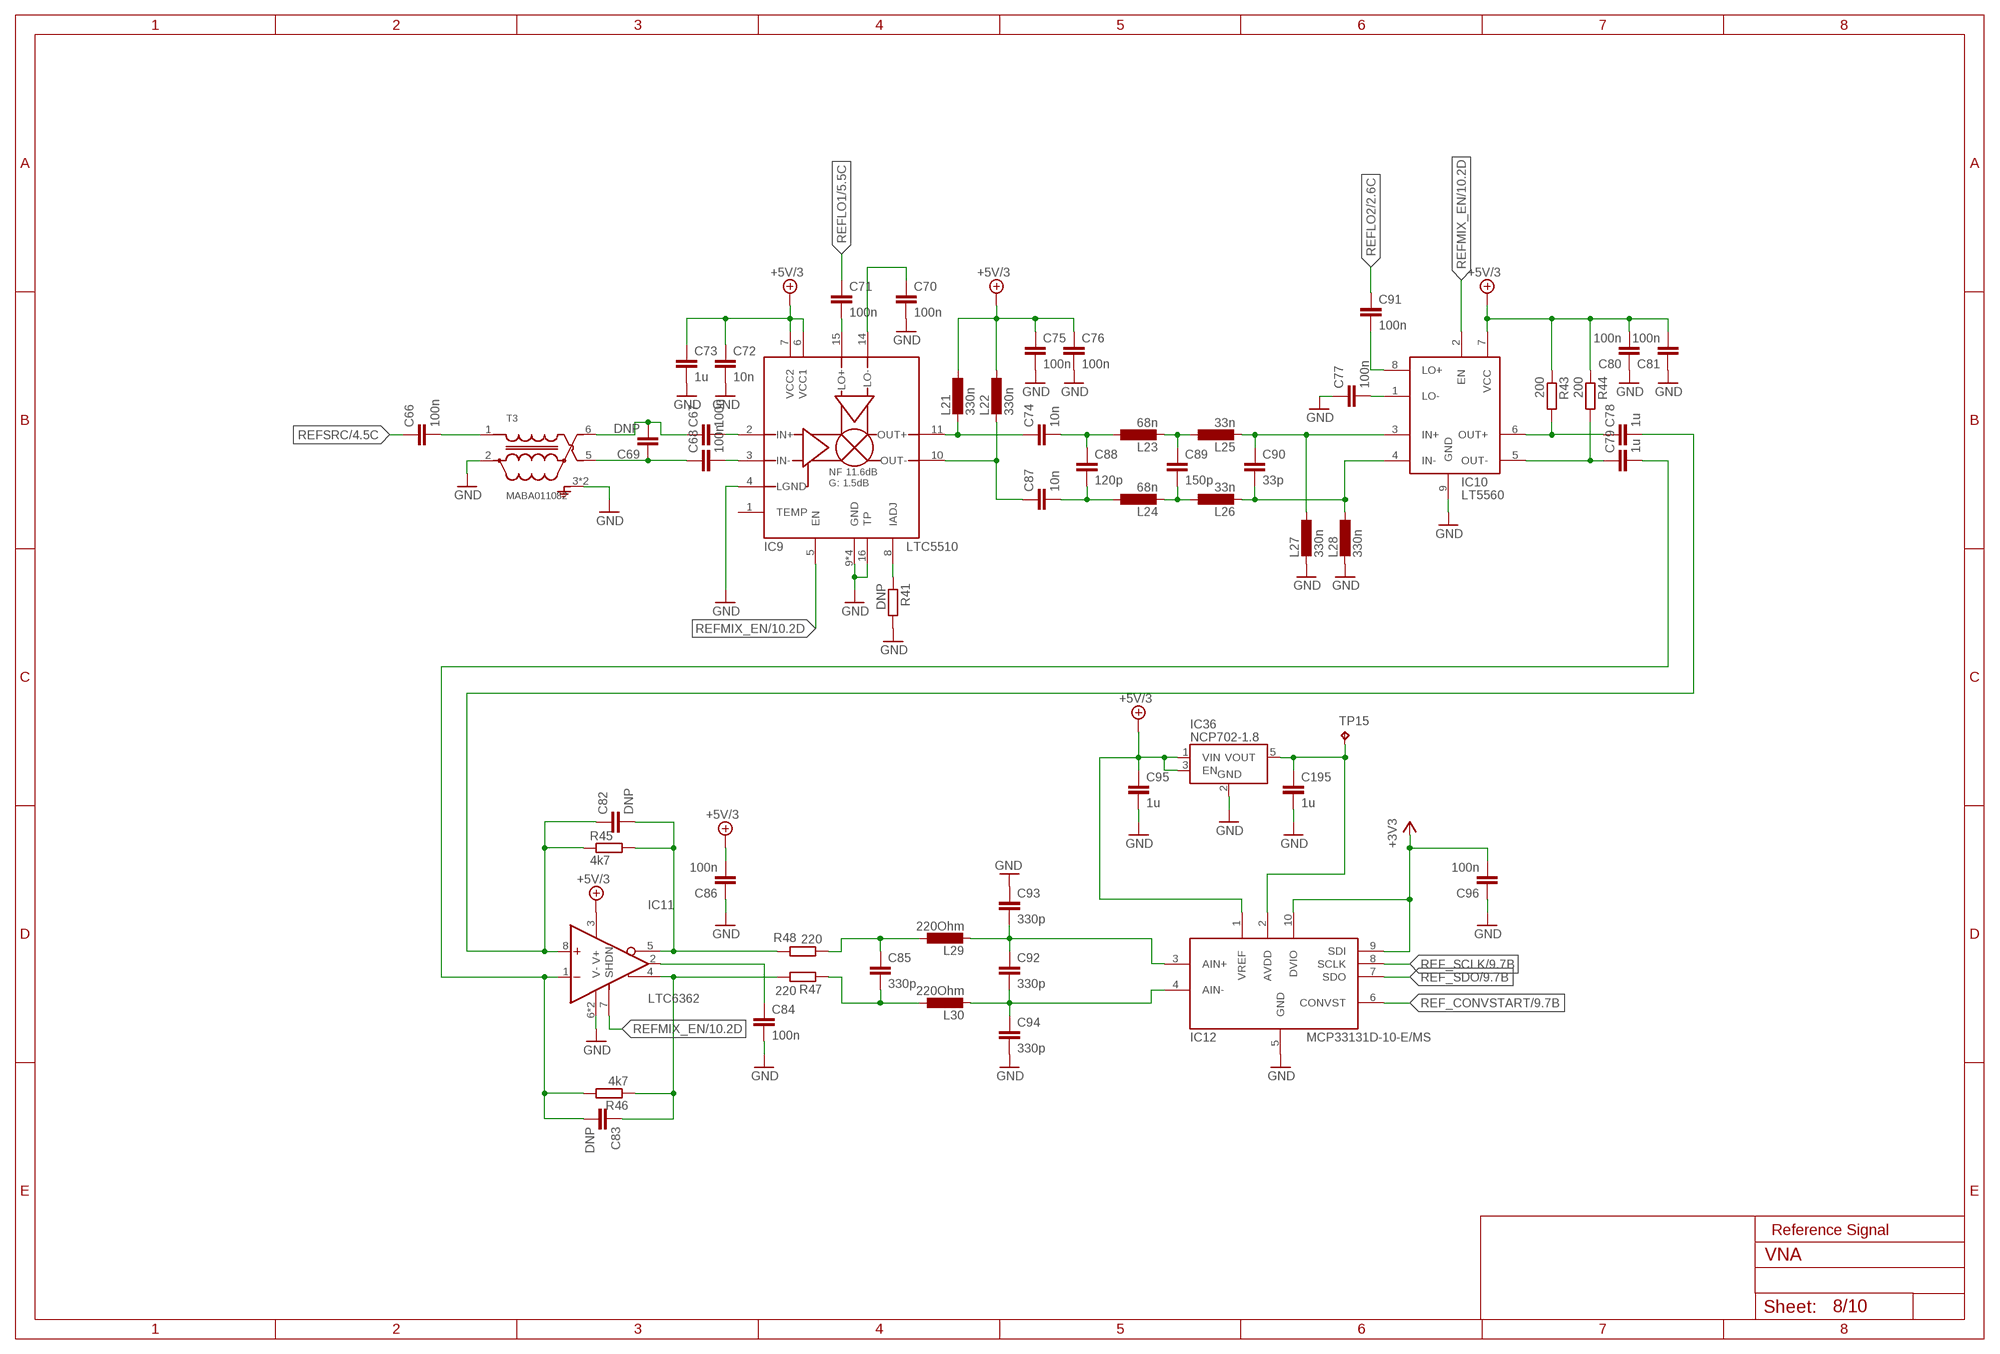
[diagram p7: schematic, sheet 8]

### Parts
C66  100n  C-EUC0603  [C0603]
C67  100n  C-EUC0603  [C0603]
C68  100n  C-EUC0603  [C0603]
C69  DNP  C-EUC0603  [C0603]
C70  100n  C-EUC0603  [C0603]
C71  100n  C-EUC0603  [C0603]
C72  10n  C-EUC0603  [C0603]
C73  1u  C-EUC0603  [C0603]
C74  10n  C-EUC0603  [C0603]
C75  100n  C-EUC0603  [C0603]
C76  100n  C-EUC0603  [C0603]
C77  100n  C-EUC0603  [C0603]
C78  1u  C-EUC0603  [C0603]
C79  1u  C-EUC0603  [C0603]
C80  100n  C-EUC0603  [C0603]
C81  100n  C-EUC0603  [C0603]
C82  DNP  C-EUC0603  [C0603]
C83  DNP  C-EUC0603  [C0603]
C84  100n  C-EUC0603  [C0603]
C85  330p  C-EUC0603  [C0603]
C86  100n  C-EUC0603  [C0603]
C87  10n  C-EUC0603  [C0603]
C88  120p  C-EUC0603  [C0603]
C89  150p  C-EUC0603  [C0603]
C90  33p  C-EUC0603  [C0603]
C91  100n  C-EUC0603  [C0603]
C92  330p  C-EUC0603  [C0603]
C93  330p  C-EUC0603  [C0603]
C94  330p  C-EUC0603  [C0603]
C95  1u  C-EUC0603  [C0603]
C96  100n  C-EUC0603  [C0603]
C195  1u  C-EUC0603  [C0603]
IC9  LTC5510  [QFN65P400X400X75-17T215N]
IC10  LT5560  [SON50P300X300X80-9T165X238]
IC11  LTC6362  [SON50P300X300X80-9T165X238]
IC12  MCP33131D-10-E/MS  [SOP50P490X110-10N]
IC36  NCP702-1.8  NCP702  [SOT95P240X110-5]
L21  330n  INDUCTOR0603  [R0603]
L22  330n  INDUCTOR0603  [R0603]
L23  68n  INDUCTOR0603  [R0603]
L24  68n  INDUCTOR0603  [R0603]
L25  33n  INDUCTOR0603  [R0603]
L26  33n  INDUCTOR0603  [R0603]
L27  330n  INDUCTOR0603  [R0603]
L28  330n  INDUCTOR0603  [R0603]
L29  220Ohm  INDUCTOR0603  [R0603]
L30  220Ohm  INDUCTOR0603  [R0603]
R41  DNP  R-EU_R0603  [R0603]
R43  200  R-EU_R0603  [R0603]
R44  200  R-EU_R0603  [R0603]
R45  4k7  R-EU_R0603  [R0603]
R46  4k7  R-EU_R0603  [R0603]
R47  220  R-EU_R0603  [R0603]
R48  220  R-EU_R0603  [R0603]
T3  MABA011082  [MACOM_BALUN]
TP15  TPB1,27  [B1,27]

### Nets
+3V3: C96.2 IC12.9(SDI) IC12.10(DVIO) ; also sheet 1,2,3,4,5,6,7,9,10
+5V/3: C72.1 C73.1 C75.1 C76.1 C80.2 C81.2 C86.2 C95.1 IC9.6(VCC1) IC9.7(VCC2) IC10.7(VCC) IC11.3(V+) IC12.1(VREF) IC36.1(VIN) IC36.3(EN) L21.1 L22.1 R43.1 R44.1 ; also sheet 1
GND: C70.2 C72.2 C73.2 C75.2 C76.2 C77.1 C80.1 C81.1 C84.2 C86.1 C93.1 C94.2 C95.2 C96.1 C195.2 IC9.4(LGND) IC9.9(GND) IC9.12(GND) IC9.13(GND) IC9.16(TP) IC9.17(GND) IC10.9(GND) IC11.6(V-) IC11.9(V-) IC12.5(GND) IC36.2(GND) L27.2 L28.2 R41.2 T3.2(PIN2) T3.3(GND) T3.4(GND) ; also sheet 1,2,3,4,5,6,7,9,10
N$61: C66.2 T3.1(PIN1)
N$66: C67.2 IC9.2(IN+)
N$67: C68.2 IC9.3(IN-)
N$68: C68.1 C69.1 T3.5(PIN5)
N$69: C67.1 C69.2 T3.6(PIN6)
N$70: C70.1 IC9.14(LO-)
N$71: C71.2 IC9.15(LO+)
N$72: C74.1 IC9.11(OUT+) L21.2
N$73: C87.1 IC9.10(OUT-) L22.2
N$74: IC9.8(IADJ) R41.1
N$75: C77.2 IC10.1(LO-)
N$76: C78.1 IC10.6(OUT+) R43.2
N$77: C79.1 IC10.5(OUT-) R44.2
N$78: C78.2 C82.1 IC11.8(+IN) R45.1
N$79: C79.2 C83.2 IC11.1(-IN) R46.2
N$80: C83.1 IC11.4(+OUT) R46.1 R47.2
N$81: C82.2 IC11.5(-OUT) R45.2 R48.2
N$82: C74.2 C88.1 L23.1
N$83: C87.2 C88.2 L24.1
N$84: C89.2 L24.2 L26.1
N$85: C89.1 L23.2 L25.1
N$86: C90.1 IC10.3(IN+) L25.2 L27.1
N$87: C90.2 IC10.4(IN-) L26.2 L28.1
N$88: C91.2 IC10.8(LO+)
N$89: C92.1 C93.2 IC12.3(AIN+) L29.2
N$90: C92.2 C94.1 IC12.4(AIN-) L30.2
N$205: C195.1 IC12.2(AVDD) IC36.5(VOUT) TP15.TP
OUT+2: C85.1 L29.1 R48.1
OUT-2: C85.2 L30.1 R47.1
OUT_CM2: C84.1 IC11.2(VOCM)
REF_CONVSTART: IC12.6(CONVST) ; also sheet 9
REF_SCLK: IC12.8(SCLK) ; also sheet 9
REF_SDO: IC12.7(SDO) ; also sheet 9
REFLO1: C71.1 ; also sheet 5
REFLO2: C91.1 ; also sheet 2
REFMIX_EN: IC9.5(EN) IC10.2(EN) IC11.7(SHDN) ; also sheet 10
REFSRC: C66.1 ; also sheet 4
Unconnected: IC9.1(TEMP)

### Notes on the sheet
- Reference Signal

## Sheet 9 of 10
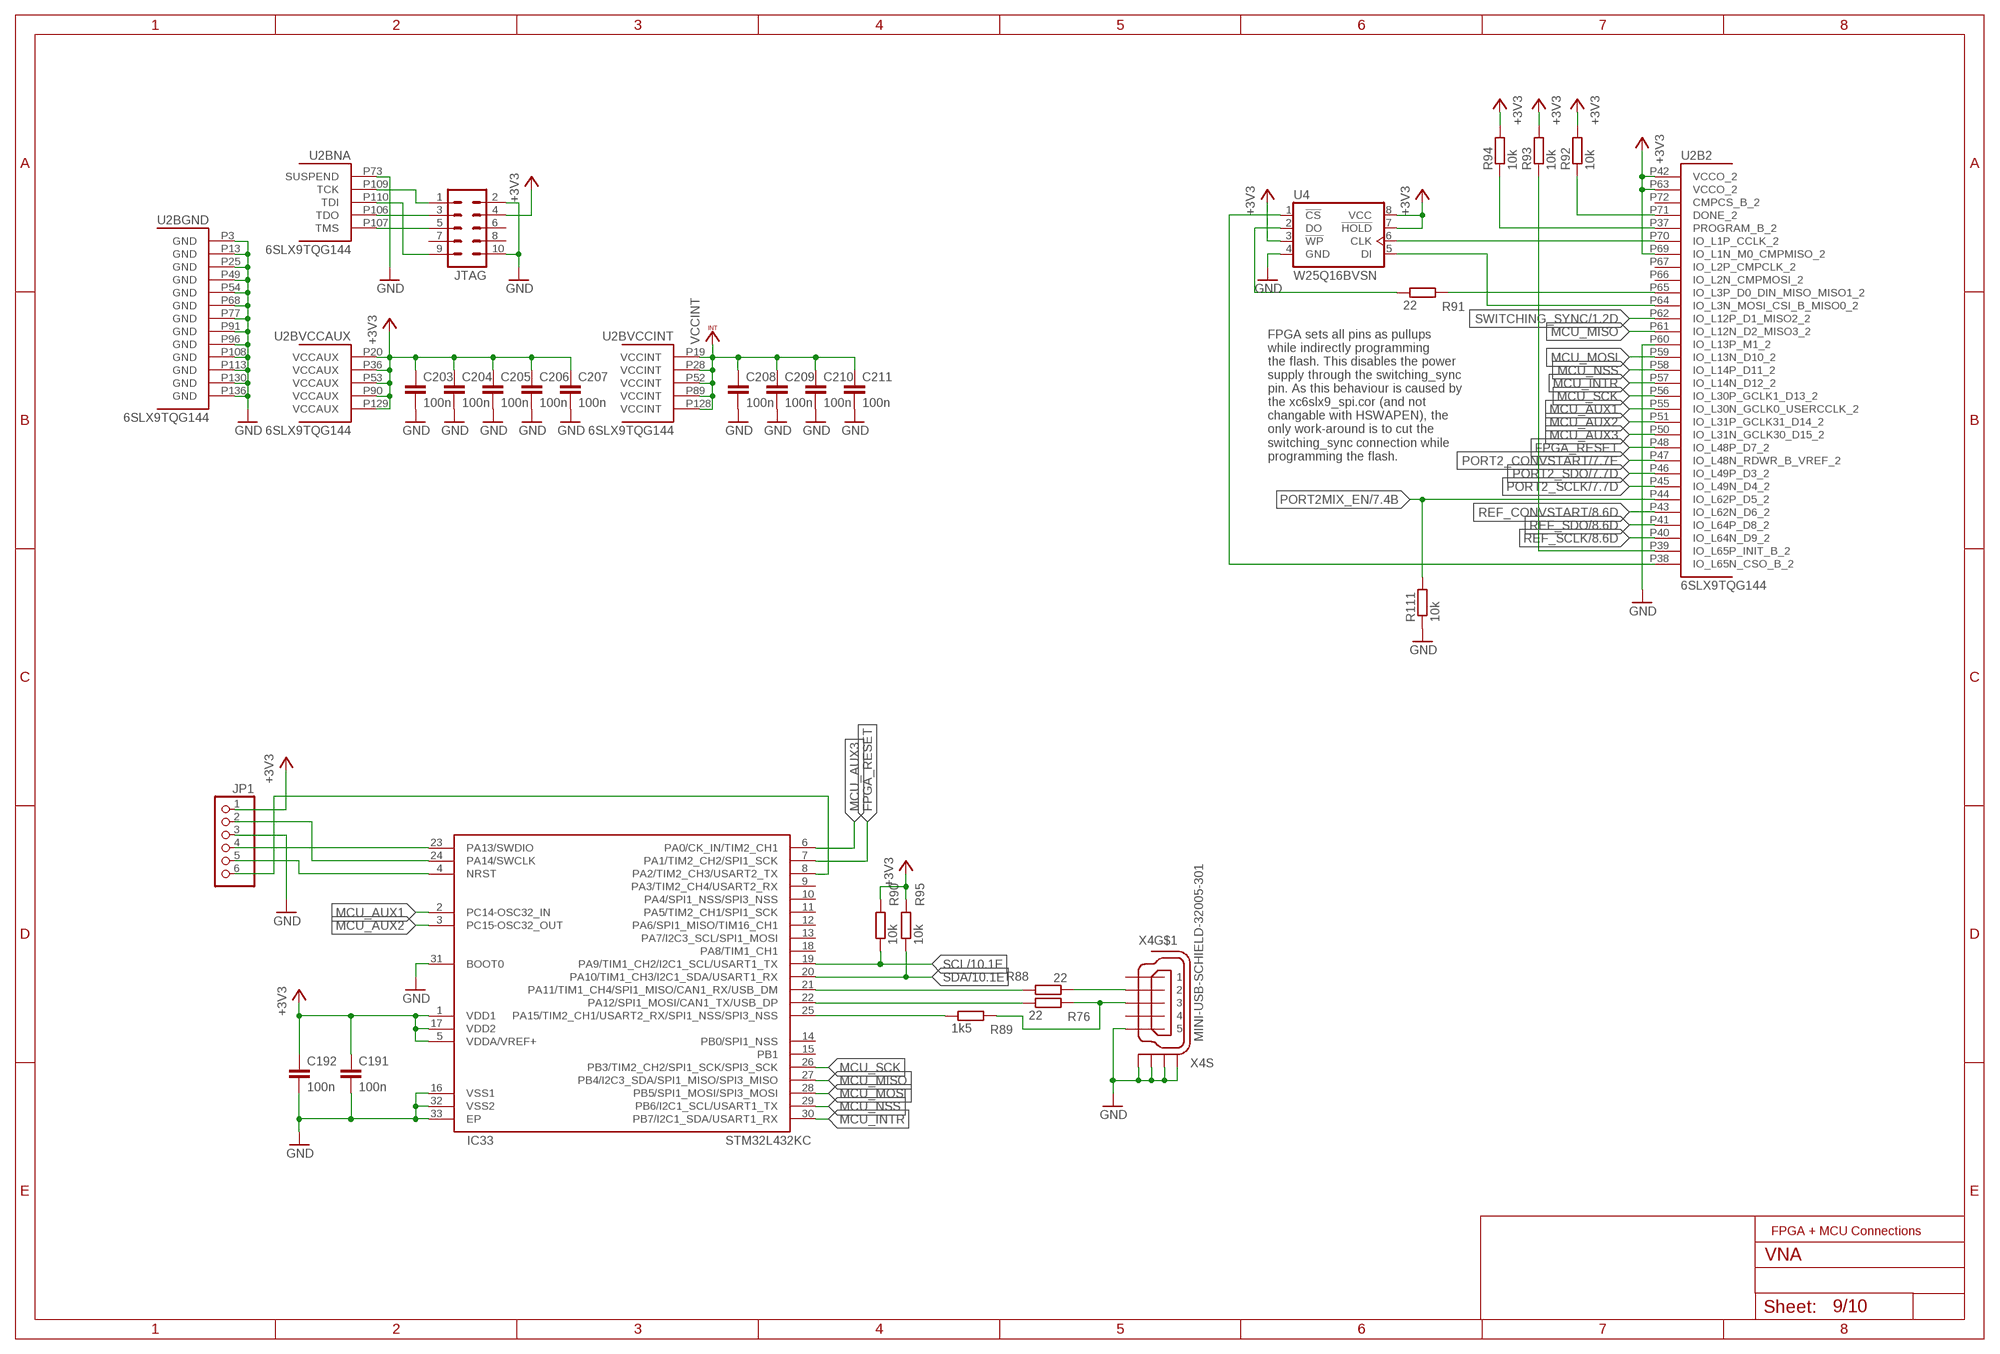
[diagram p8: schematic, sheet 9]

### Parts
C191  100n  C-EUC0603  [C0603]
C192  100n  C-EUC0603  [C0603]
C203  100n  C-EUC0603  [C0603]
C204  100n  C-EUC0603  [C0603]
C205  100n  C-EUC0603  [C0603]
C206  100n  C-EUC0603  [C0603]
C207  100n  C-EUC0603  [C0603]
C208  100n  C-EUC0603  [C0603]
C209  100n  C-EUC0603  [C0603]
C210  100n  C-EUC0603  [C0603]
C211  100n  C-EUC0603  [C0603]
IC33  STM32L432KC  [QFN50P500X500X100-33T345N]
JP1  PINHD-1X6  [1X06]
JTAG  ML10  [ML10]
R76  22  R-EU_R0603  [R0603]
R88  22  R-EU_R0603  [R0603]
R89  1k5  R-EU_R0603  [R0603]
R90  10k  R-EU_R0603  [R0603]
R91  22  R-EU_R0603  [R0603]
R92  10k  R-EU_R0603  [R0603]
R93  10k  R-EU_R0603  [R0603]
R94  10k  R-EU_R0603  [R0603]
R95  10k  R-EU_R0603  [R0603]
R111  10k  R-EU_R0603  [R0603]
U2  6SLX9TQG144  [TQ144]
U4  W25Q16BVSN  [SO08]
X4  MINI-USB-SCHIELD-32005-301  [32005-301]

### Nets
+3V3: C191.1 C192.1 C203.1 C204.1 C205.1 C206.1 C207.1 IC33.1(VDD1) IC33.5(VDDA/VREF+) IC33.17(VDD2) JP1.1 JTAG.4 R90.2 R92.2 R93.2 R94.2 R95.2 U2.P20(BVCCAUX:VCCAUX) U2.P36(BVCCAUX:VCCAUX) U2.P42(B2:VCCO_2) U2.P53(BVCCAUX:VCCAUX) U2.P63(B2:VCCO_2) U2.P69(B2:IO_L1N_M0_CMPMISO_2) U2.P90(BVCCAUX:VCCAUX) U2.P129(BVCCAUX:VCCAUX) U4.3(!WP!) U4.7(!HOLD!) U4.8(VCC) ; also sheet 1,2,3,4,5,6,7,8,10
FLACH_MOSI: U2.P64(B2:IO_L3N_MOSI_CSI_B_MISO0_2) U4.5(DI)
FLASH_CLK: U2.P70(B2:IO_L1P_CCLK_2) U4.6(CLK)
FLASH_CS: U2.P38(B2:IO_L65N_CSO_B_2) U4.1(!CS!)
FLASH_MISO: R91.1 U4.2(DO)
FPGA_RESET: IC33.7(PA1/TIM2_CH2/SPI1_SCK) U2.P48(B2:IO_L48P_D7_2)
GND: C191.2 C192.2 C203.2 C204.2 C205.2 C206.2 C207.2 C208.2 C209.2 C210.2 C211.2 IC33.16(VSS1) IC33.31(BOOT0) IC33.32(VSS2) IC33.33(EP) JP1.3 JTAG.2 JTAG.10 R111.1 U2.P3(BGND:GND) U2.P13(BGND:GND) U2.P25(BGND:GND) U2.P49(BGND:GND) U2.P54(BGND:GND) U2.P60(B2:IO_L13P_M1_2) U2.P68(BGND:GND) U2.P73(BNA:SUSPEND) U2.P77(BGND:GND) U2.P91(BGND:GND) U2.P96(BGND:GND) U2.P108(BGND:GND) U2.P113(BGND:GND) U2.P130(BGND:GND) U2.P136(BGND:GND) U4.4(GND) X4.5 X4.M1(S:S1) X4.M2(S:S2) X4.M3(S:S3) X4.M4(S:S4) ; also sheet 1,2,3,4,5,6,7,8,10
MCU_AUX1: IC33.2(PC14-OSC32_IN) U2.P55(B2:IO_L30N_GCLK0_USERCCLK_2)
MCU_AUX2: IC33.3(PC15-OSC32_OUT) U2.P51(B2:IO_L31P_GCLK31_D14_2)
MCU_AUX3: IC33.6(PA0/CK_IN/TIM2_CH1) U2.P50(B2:IO_L31N_GCLK30_D15_2)
MCU_INTR: IC33.30(PB7/I2C1_SDA/USART1_RX) U2.P57(B2:IO_L14N_D12_2)
MCU_MISO: IC33.27(PB4/I2C3_SDA/SPI1_MISO/SPI3_MISO) U2.P61(B2:IO_L12N_D2_MISO3_2)
MCU_MOSI: IC33.28(PB5/SPI1_MOSI/SPI3_MOSI) U2.P59(B2:IO_L13N_D10_2)
MCU_NSS: IC33.29(PB6/I2C1_SCL/USART1_TX) U2.P58(B2:IO_L14P_D11_2)
MCU_SCK: IC33.26(PB3/TIM2_CH2/SPI1_SCK/SPI3_SCK) U2.P56(B2:IO_L30P_GCLK1_D13_2)
N$165: JTAG.3 U2.P106(BNA:TDO)
N$173: JTAG.5 U2.P107(BNA:TMS)
N$175: JTAG.9 U2.P110(BNA:TDI)
N$183: JTAG.1 U2.P109(BNA:TCK)
N$185: R88.1 X4.2
N$186: R76.2 R89.2 X4.3
N$187: IC33.21(PA11/TIM1_CH4/SPI1_MISO/CAN1_RX/USB_DM) R88.2
N$188: IC33.22(PA12/SPI1_MOSI/CAN1_TX/USB_DP) R76.1
N$189: IC33.25(PA15/TIM2_CH1/USART2_RX/SPI1_NSS/SPI3_NSS) R89.1
N$190: IC33.24(PA14/SWCLK) JP1.2
N$191: IC33.23(PA13/SWDIO) JP1.4
N$192: IC33.4(NRST) JP1.5
N$193: IC33.8(PA2/TIM2_CH3/USART2_TX) JP1.6
N$194: R92.1 U2.P71(B2:DONE_2)
N$195: R93.1 U2.P39(B2:IO_L65P_INIT_B_2)
N$196: R94.1 U2.P37(B2:PROGRAM_B_2)
N$197: R91.2 U2.P65(B2:IO_L3P_D0_DIN_MISO_MISO1_2)
PORT2_CONVSTART: U2.P47(B2:IO_L48N_RDWR_B_VREF_2) ; also sheet 7
PORT2_SCLK: U2.P45(B2:IO_L49N_D4_2) ; also sheet 7
PORT2_SDO: U2.P46(B2:IO_L49P_D3_2) ; also sheet 7
PORT2MIX_EN: R111.2 U2.P44(B2:IO_L62P_D5_2) ; also sheet 7
REF_CONVSTART: U2.P43(B2:IO_L62N_D6_2) ; also sheet 8
REF_SCLK: U2.P40(B2:IO_L64N_D9_2) ; also sheet 8
REF_SDO: U2.P41(B2:IO_L64P_D8_2) ; also sheet 8
SCL: IC33.19(PA9/TIM1_CH2/I2C1_SCL/USART1_TX) R90.1 ; also sheet 2,10
SDA: IC33.20(PA10/TIM1_CH3/I2C1_SDA/USART1_RX) R95.1 ; also sheet 2,10
SWITCHING_SYNC: U2.P62(B2:IO_L12P_D1_MISO2_2) ; also sheet 1
VCCINT: C208.1 C209.1 C210.1 C211.1 U2.P19(BVCCINT:VCCINT) U2.P28(BVCCINT:VCCINT) U2.P52(BVCCINT:VCCINT) U2.P89(BVCCINT:VCCINT) U2.P128(BVCCINT:VCCINT) ; also sheet 1
Unconnected: IC33.9(PA3/TIM2_CH4/USART2_RX) IC33.10(PA4/SPI1_NSS/SPI3_NSS) IC33.11(PA5/TIM2_CH1/SPI1_SCK) IC33.12(PA6/SPI1_MISO/TIM16_CH1) IC33.13(PA7/I2C3_SCL/SPI1_MOSI) IC33.14(PB0/SPI1_NSS) IC33.15(PB1) IC33.18(PA8/TIM1_CH1) JTAG.6 JTAG.7 JTAG.8 U2.P66(B2:IO_L2N_CMPMOSI_2) U2.P67(B2:IO_L2P_CMPCLK_2) U2.P72(B2:CMPCS_B_2) X4.1 X4.4

### Notes on the sheet
- FPGA sets all pins as pullups
  while indirectly programming
  the flash. This disables the power
  supply through the switching_sync
  pin. As this behaviour is caused by
  the xc6slx9_spi.cor (and not
  changable with HSWAPEN), the
  only work-around is to cut the
  switching_sync connection while
  programming the flash.
- FPGA + MCU Connections

## Sheet 10 of 10
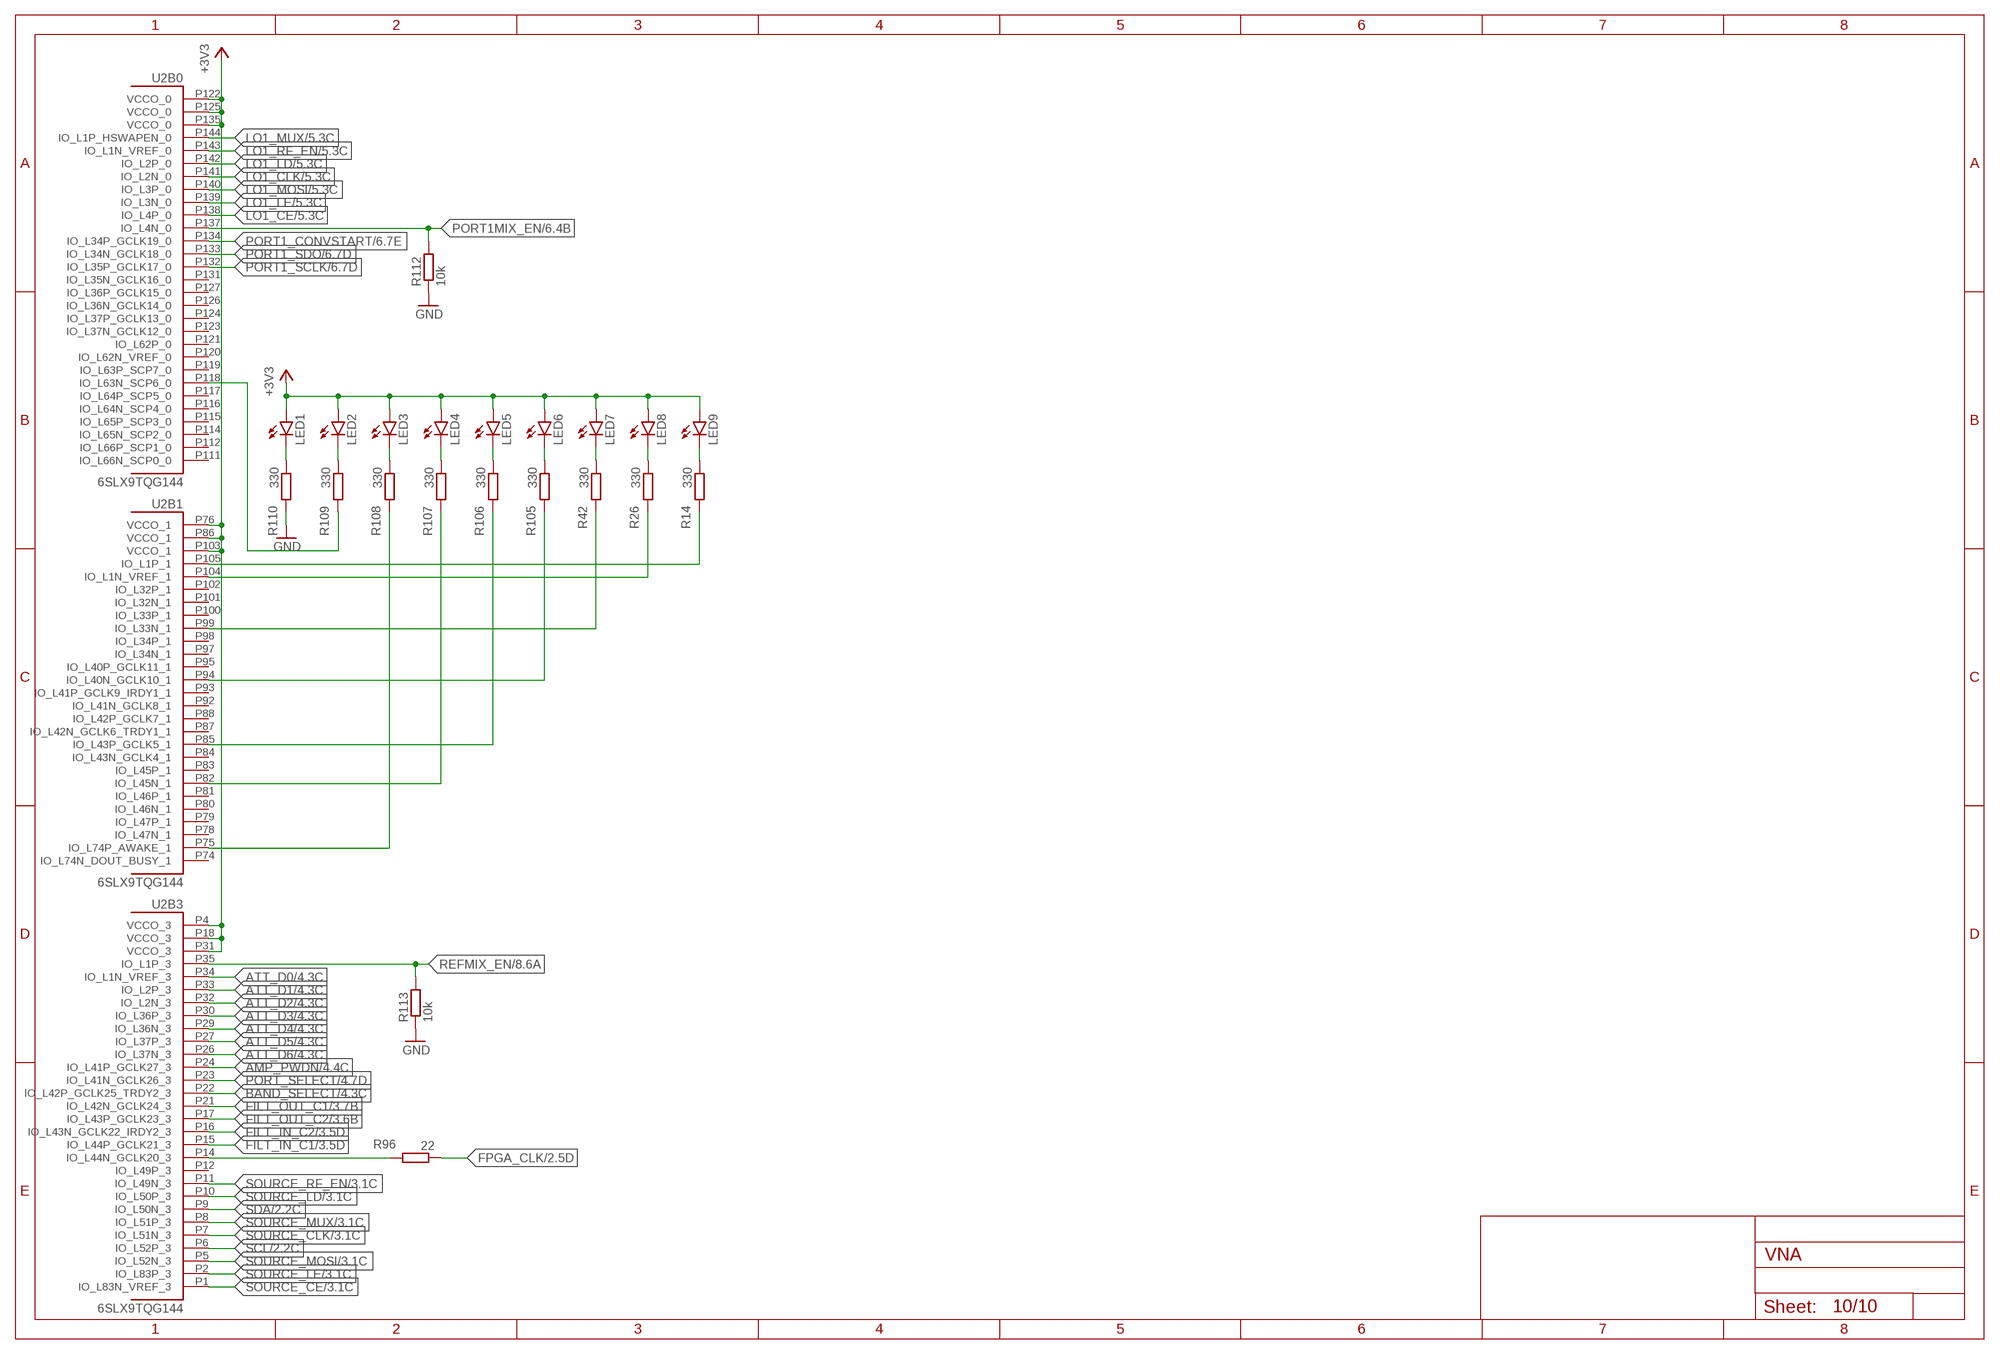
[diagram p9: schematic, sheet 10]

### Parts
LED1  LEDCHIPLED_0603  [CHIPLED_0603]
LED2  LEDCHIPLED_0603  [CHIPLED_0603]
LED3  LEDCHIPLED_0603  [CHIPLED_0603]
LED4  LEDCHIPLED_0603  [CHIPLED_0603]
LED5  LEDCHIPLED_0603  [CHIPLED_0603]
LED6  LEDCHIPLED_0603  [CHIPLED_0603]
LED7  LEDCHIPLED_0603  [CHIPLED_0603]
LED8  LEDCHIPLED_0603  [CHIPLED_0603]
LED9  LEDCHIPLED_0603  [CHIPLED_0603]
R14  330  R-EU_R0603  [R0603]
R26  330  R-EU_R0603  [R0603]
R42  330  R-EU_R0603  [R0603]
R96  22  R-EU_R0603  [R0603]
R105  330  R-EU_R0603  [R0603]
R106  330  R-EU_R0603  [R0603]
R107  330  R-EU_R0603  [R0603]
R108  330  R-EU_R0603  [R0603]
R109  330  R-EU_R0603  [R0603]
R110  330  R-EU_R0603  [R0603]
R112  10k  R-EU_R0603  [R0603]
R113  10k  R-EU_R0603  [R0603]

### Nets
+3V3: LED1.A LED2.A LED3.A LED4.A LED5.A LED6.A LED7.A LED8.A LED9.A U2.P4(B3:VCCO_3) U2.P18(B3:VCCO_3) U2.P31(B3:VCCO_3) U2.P76(B1:VCCO_1) U2.P86(B1:VCCO_1) U2.P103(B1:VCCO_1) U2.P122(B0:VCCO_0) U2.P125(B0:VCCO_0) U2.P135(B0:VCCO_0) ; also sheet 1,2,3,4,5,6,7,8,9
AMP_PWDN: U2.P24(B3:IO_L41P_GCLK27_3) ; also sheet 4
ATT_D0: U2.P34(B3:IO_L1N_VREF_3) ; also sheet 4
ATT_D1: U2.P33(B3:IO_L2P_3) ; also sheet 4
ATT_D2: U2.P32(B3:IO_L2N_3) ; also sheet 4
ATT_D3: U2.P30(B3:IO_L36P_3) ; also sheet 4
ATT_D4: U2.P29(B3:IO_L36N_3) ; also sheet 4
ATT_D5: U2.P27(B3:IO_L37P_3) ; also sheet 4
ATT_D6: U2.P26(B3:IO_L37N_3) ; also sheet 4
BAND_SELECT: U2.P22(B3:IO_L42P_GCLK25_TRDY2_3) ; also sheet 4
FILT_IN_C1: U2.P15(B3:IO_L44P_GCLK21_3) ; also sheet 3
FILT_IN_C2: U2.P16(B3:IO_L43N_GCLK22_IRDY2_3) ; also sheet 3
FILT_OUT_C1: U2.P21(B3:IO_L42N_GCLK24_3) ; also sheet 3
FILT_OUT_C2: U2.P17(B3:IO_L43P_GCLK23_3) ; also sheet 3
FPGA_CLK: R96.1 ; also sheet 2
GND: R110.2 R112.1 R113.1 ; also sheet 1,2,3,4,5,6,7,8,9
LO1_CE: U2.P138(B0:IO_L4P_0) ; also sheet 5
LO1_CLK: U2.P141(B0:IO_L2N_0) ; also sheet 5
LO1_LD: U2.P142(B0:IO_L2P_0) ; also sheet 5
LO1_LE: U2.P139(B0:IO_L3N_0) ; also sheet 5
LO1_MOSI: U2.P140(B0:IO_L3P_0) ; also sheet 5
LO1_MUX: U2.P144(B0:IO_L1P_HSWAPEN_0) ; also sheet 5
LO1_RF_EN: U2.P143(B0:IO_L1N_VREF_0) ; also sheet 5
N$198: R96.2 U2.P14(B3:IO_L44N_GCLK20_3)
N$206: LED9.C R14.1
N$207: LED8.C R26.1
N$208: LED7.C R42.1
N$209: LED6.C R105.1
N$210: LED5.C R106.1
N$211: LED4.C R107.1
N$212: LED3.C R108.1
N$213: LED2.C R109.1
N$214: LED1.C R110.1
N$215: R14.2 U2.P105(B1:IO_L1P_1)
N$216: R26.2 U2.P104(B1:IO_L1N_VREF_1)
N$217: R42.2 U2.P99(B1:IO_L33N_1)
N$218: R105.2 U2.P94(B1:IO_L40N_GCLK10_1)
N$219: R106.2 U2.P85(B1:IO_L43P_GCLK5_1)
N$220: R107.2 U2.P82(B1:IO_L45N_1)
N$221: R108.2 U2.P75(B1:IO_L74P_AWAKE_1)
N$222: R109.2 U2.P118(B0:IO_L63N_SCP6_0)
PORT1_CONVSTART: U2.P134(B0:IO_L34P_GCLK19_0) ; also sheet 6
PORT1_SCLK: U2.P132(B0:IO_L35P_GCLK17_0) ; also sheet 6
PORT1_SDO: U2.P133(B0:IO_L34N_GCLK18_0) ; also sheet 6
PORT1MIX_EN: R112.2 U2.P137(B0:IO_L4N_0) ; also sheet 6
PORT_SELECT: U2.P23(B3:IO_L41N_GCLK26_3) ; also sheet 4
REFMIX_EN: R113.2 U2.P35(B3:IO_L1P_3) ; also sheet 8
SCL: U2.P6(B3:IO_L52P_3) ; also sheet 2,9
SDA: U2.P9(B3:IO_L50N_3) ; also sheet 2,9
SOURCE_CE: U2.P1(B3:IO_L83N_VREF_3) ; also sheet 3
SOURCE_CLK: U2.P7(B3:IO_L51N_3) ; also sheet 3
SOURCE_LD: U2.P10(B3:IO_L50P_3) ; also sheet 3
SOURCE_LE: U2.P2(B3:IO_L83P_3) ; also sheet 3
SOURCE_MOSI: U2.P5(B3:IO_L52N_3) ; also sheet 3
SOURCE_MUX: U2.P8(B3:IO_L51P_3) ; also sheet 3
SOURCE_RF_EN: U2.P11(B3:IO_L49N_3) ; also sheet 3
Unconnected: U2.P12(B3:IO_L49P_3) U2.P74(B1:IO_L74N_DOUT_BUSY_1) U2.P78(B1:IO_L47N_1) U2.P79(B1:IO_L47P_1) U2.P80(B1:IO_L46N_1) U2.P81(B1:IO_L46P_1) U2.P83(B1:IO_L45P_1) U2.P84(B1:IO_L43N_GCLK4_1) U2.P87(B1:IO_L42N_GCLK6_TRDY1_1) U2.P88(B1:IO_L42P_GCLK7_1) U2.P92(B1:IO_L41N_GCLK8_1) U2.P93(B1:IO_L41P_GCLK9_IRDY1_1) U2.P95(B1:IO_L40P_GCLK11_1) U2.P97(B1:IO_L34N_1) U2.P98(B1:IO_L34P_1) U2.P100(B1:IO_L33P_1) U2.P101(B1:IO_L32N_1) U2.P102(B1:IO_L32P_1) U2.P111(B0:IO_L66N_SCP0_0) U2.P112(B0:IO_L66P_SCP1_0) U2.P114(B0:IO_L65N_SCP2_0) U2.P115(B0:IO_L65P_SCP3_0) U2.P116(B0:IO_L64N_SCP4_0) U2.P117(B0:IO_L64P_SCP5_0) U2.P119(B0:IO_L63P_SCP7_0) U2.P120(B0:IO_L62N_VREF_0) U2.P121(B0:IO_L62P_0) U2.P123(B0:IO_L37N_GCLK12_0) U2.P124(B0:IO_L37P_GCLK13_0) U2.P126(B0:IO_L36N_GCLK14_0) U2.P127(B0:IO_L36P_GCLK15_0) U2.P131(B0:IO_L35N_GCLK16_0)

## Library data of the parts
C1-C105 C107-C124 C127-C140 C143-C168 C175 C176 C178 C179 C182 C183 C186-C188 C191-C195 C203-C211 = VNA:C-EU*?: CAPACITOR, European symbol
C106 C125 C126 C141 C142 C169-C174 C177 C180 C181 C184 C185 C189 C190 = VNA:C-EU: CAPACITOR, European symbol
IC1 IC5 IC9 = VNA:LTC5510
IC2 IC6 IC10 = VNA:LT5560
IC3 IC7 IC11 = VNA:LTC6362
IC4 IC8 IC12 = VNA:MCP33131D-10-E/MS
IC13 = VNA:SI5351C
IC14 IC19 = VNA:MAX2871
IC15 IC20 IC34-IC36 = VNA:NCP702
IC16 IC18 = VNA:RFSW6042
IC17 IC21 = VNA:AP2114
IC22 IC25-IC27 = VNA:F2912
IC23 = VNA:F1958
IC24 = VNA:TRF37A73
IC28-IC31 = VNA:LDL212PU50R
IC32 = VNA:TPS65265
IC33 = VNA:STM32L432KC
J1 J2 = VNA:U.FL-R-SMT: U.FL-R-SMT Antenna Connector; DIGIKEY: H122041-ND; MANUFACTURER: Hirose; MPN: U.FL-R-SMT-1(01)
J3 = VNA:DCJ0202: DC POWER JACK Source: DCJ0202.pdf; OC_FARNELL: unknown; OC_NEWARK: unknown
JP1 = VNA:PINHD-1X6: PIN HEADER
JTAG = VNA:ML10: HARTING; OC_FARNELL: unknown; OC_NEWARK: unknown
L1-L50 = VNA:INDUCTOR
L51-L55 = VNA:SRN5040
LED1-LED9 = led:LED: LED OSRAM: - CHIPLED LG R971, LG N971, LY N971, LG Q971, LY Q971, LO R971, LY R971 LH N974, LH R974 LS Q976, LO Q976, LY Q976 LO Q996 - Hyper CHIPLED LW Q18S LB Q993, LB Q99A, LB R99A - SideLED LS A670, LO A670, LY A670, LG A670, LP A670 LB A673, LV A673, LT A673, LW A673 LH A674 LY A675 LS A676, LA A676, LO A676, LY A676, LW A676 LS A679, LY A679, LG A679 - Hyper Micro SIDELED® LS Y876, LA Y876, LO Y876, LY Y876 LT Y87S - SmartLED LW L88C, LW L88S LB L89C, LB L89S, LG L890 LS L89K, LO L89K, LY L89K LS L896, LA L896, LO L896, LY L896 - TOPLED LS T670, LO T670, LY T670, LG T670, LP T670 LSG T670, LSP T670, LSY T670, LOP T670, LYG T670 LG T671, LOG T671, LSG T671 LB T673, LV T673, LT T673, LW T673 LH T674 LS T676, LA T676, LO T676, LY T676, LB T676, LH T676, LSB T676, LW T676 LB T67C, LV T67C, LT T67C, LS T67K, LO T67K, LY T67K, LW E67C LS E67B, LA E67B, LO E67B, LY E67B, LB E67C, LV E67C, LT E67C LW T67C LS T679, LY T679, LG T679 LS T770, LO T770, LY T770, LG T770, LP T770 LB T773, LV T773, LT T773, LW T773 LH T774 LS E675, LA E675, LY E675, LS T675 LS T776, LA T776, LO T776, LY T776, LB T776 LHGB T686 LT T68C, LB T68C - Hyper Mini TOPLED® LB M676 - Mini TOPLED Santana® LG M470 LS M47K, LO M47K, LY M47K Source: http://www.osram.convergy.de LUXEON: - LUMILED® LXK2-PW12-R00, LXK2-PW12-S00, LXK2-PW14-U00, LXK2-PW14-V00 LXK2-PM12-R00, LXK2-PM12-S00, LXK2-PM14-U00 LXK2-PE12-Q00, LXK2-PE12-R00, LXK2-PE12-S00, LXK2-PE14-T00, LXK2-PE14-U00 LXK2-PB12-K00, LXK2-PB12-L00, LXK2-PB12-M00, LXK2-PB14-N00, LXK2-PB14-P00, LXK2-PB14-Q00 LXK2-PR12-L00, LXK2-PR12-M00, LXK2-PR14-Q00, LXK2-PR14-R00 LXK2-PD12-Q00, LXK2-PD12-R00, LXK2-PD12-S00 LXK2-PH12-R00, LXK2-PH12-S00 LXK2-PL12-P00, LXK2-PL12-Q00, LXK2-PL12-R00 Source: www.luxeon.com KINGBRIGHT: KA-3528ASYC Source: www.kingbright.com
LP1-LP3 = VNA:LP0603A
Q1 = VNA:FA-: MHz RANGE CRYSTAL UNIT Source: Epson Toyocom
R1-R113 = VNA:R-EU_: RESISTOR, European symbol
T1-T3 = VNA:MABA011082
TP1-TP19 = testpad:TP: Test pad
U2 = VNA:6SLX9TQG144: Xilinx FPGA: 6SLX9TQG144
U4 = VNA:W25Q16BV: EEPROM 4 Mbit SPI Serial Flash7
X1 X2 = VNA:SMA_CONNECTOR
X4 = VNA:MINI-USB-SCHIELD-: MINI USB-B Conector Source: www.cypressindustries.com; OC_FARNELL: unknown; OC_NEWARK: unknown